# EasyEDA Pro project Breadboard Components.eprj

# Schematic XL74LS04
Board Name: XL74LS04; Create Date: 2024-12-03; Page Name: P1; Project Name: Breadboard Components; Schematic Name: XL74LS04; Update Date: 2024-12-03; Company: EasyEDA.com; Drawn: EasyEDA; Page Size: A4; Part Number: JLCPCB-002; Reviewed: EasyEDA; Version: V0.1
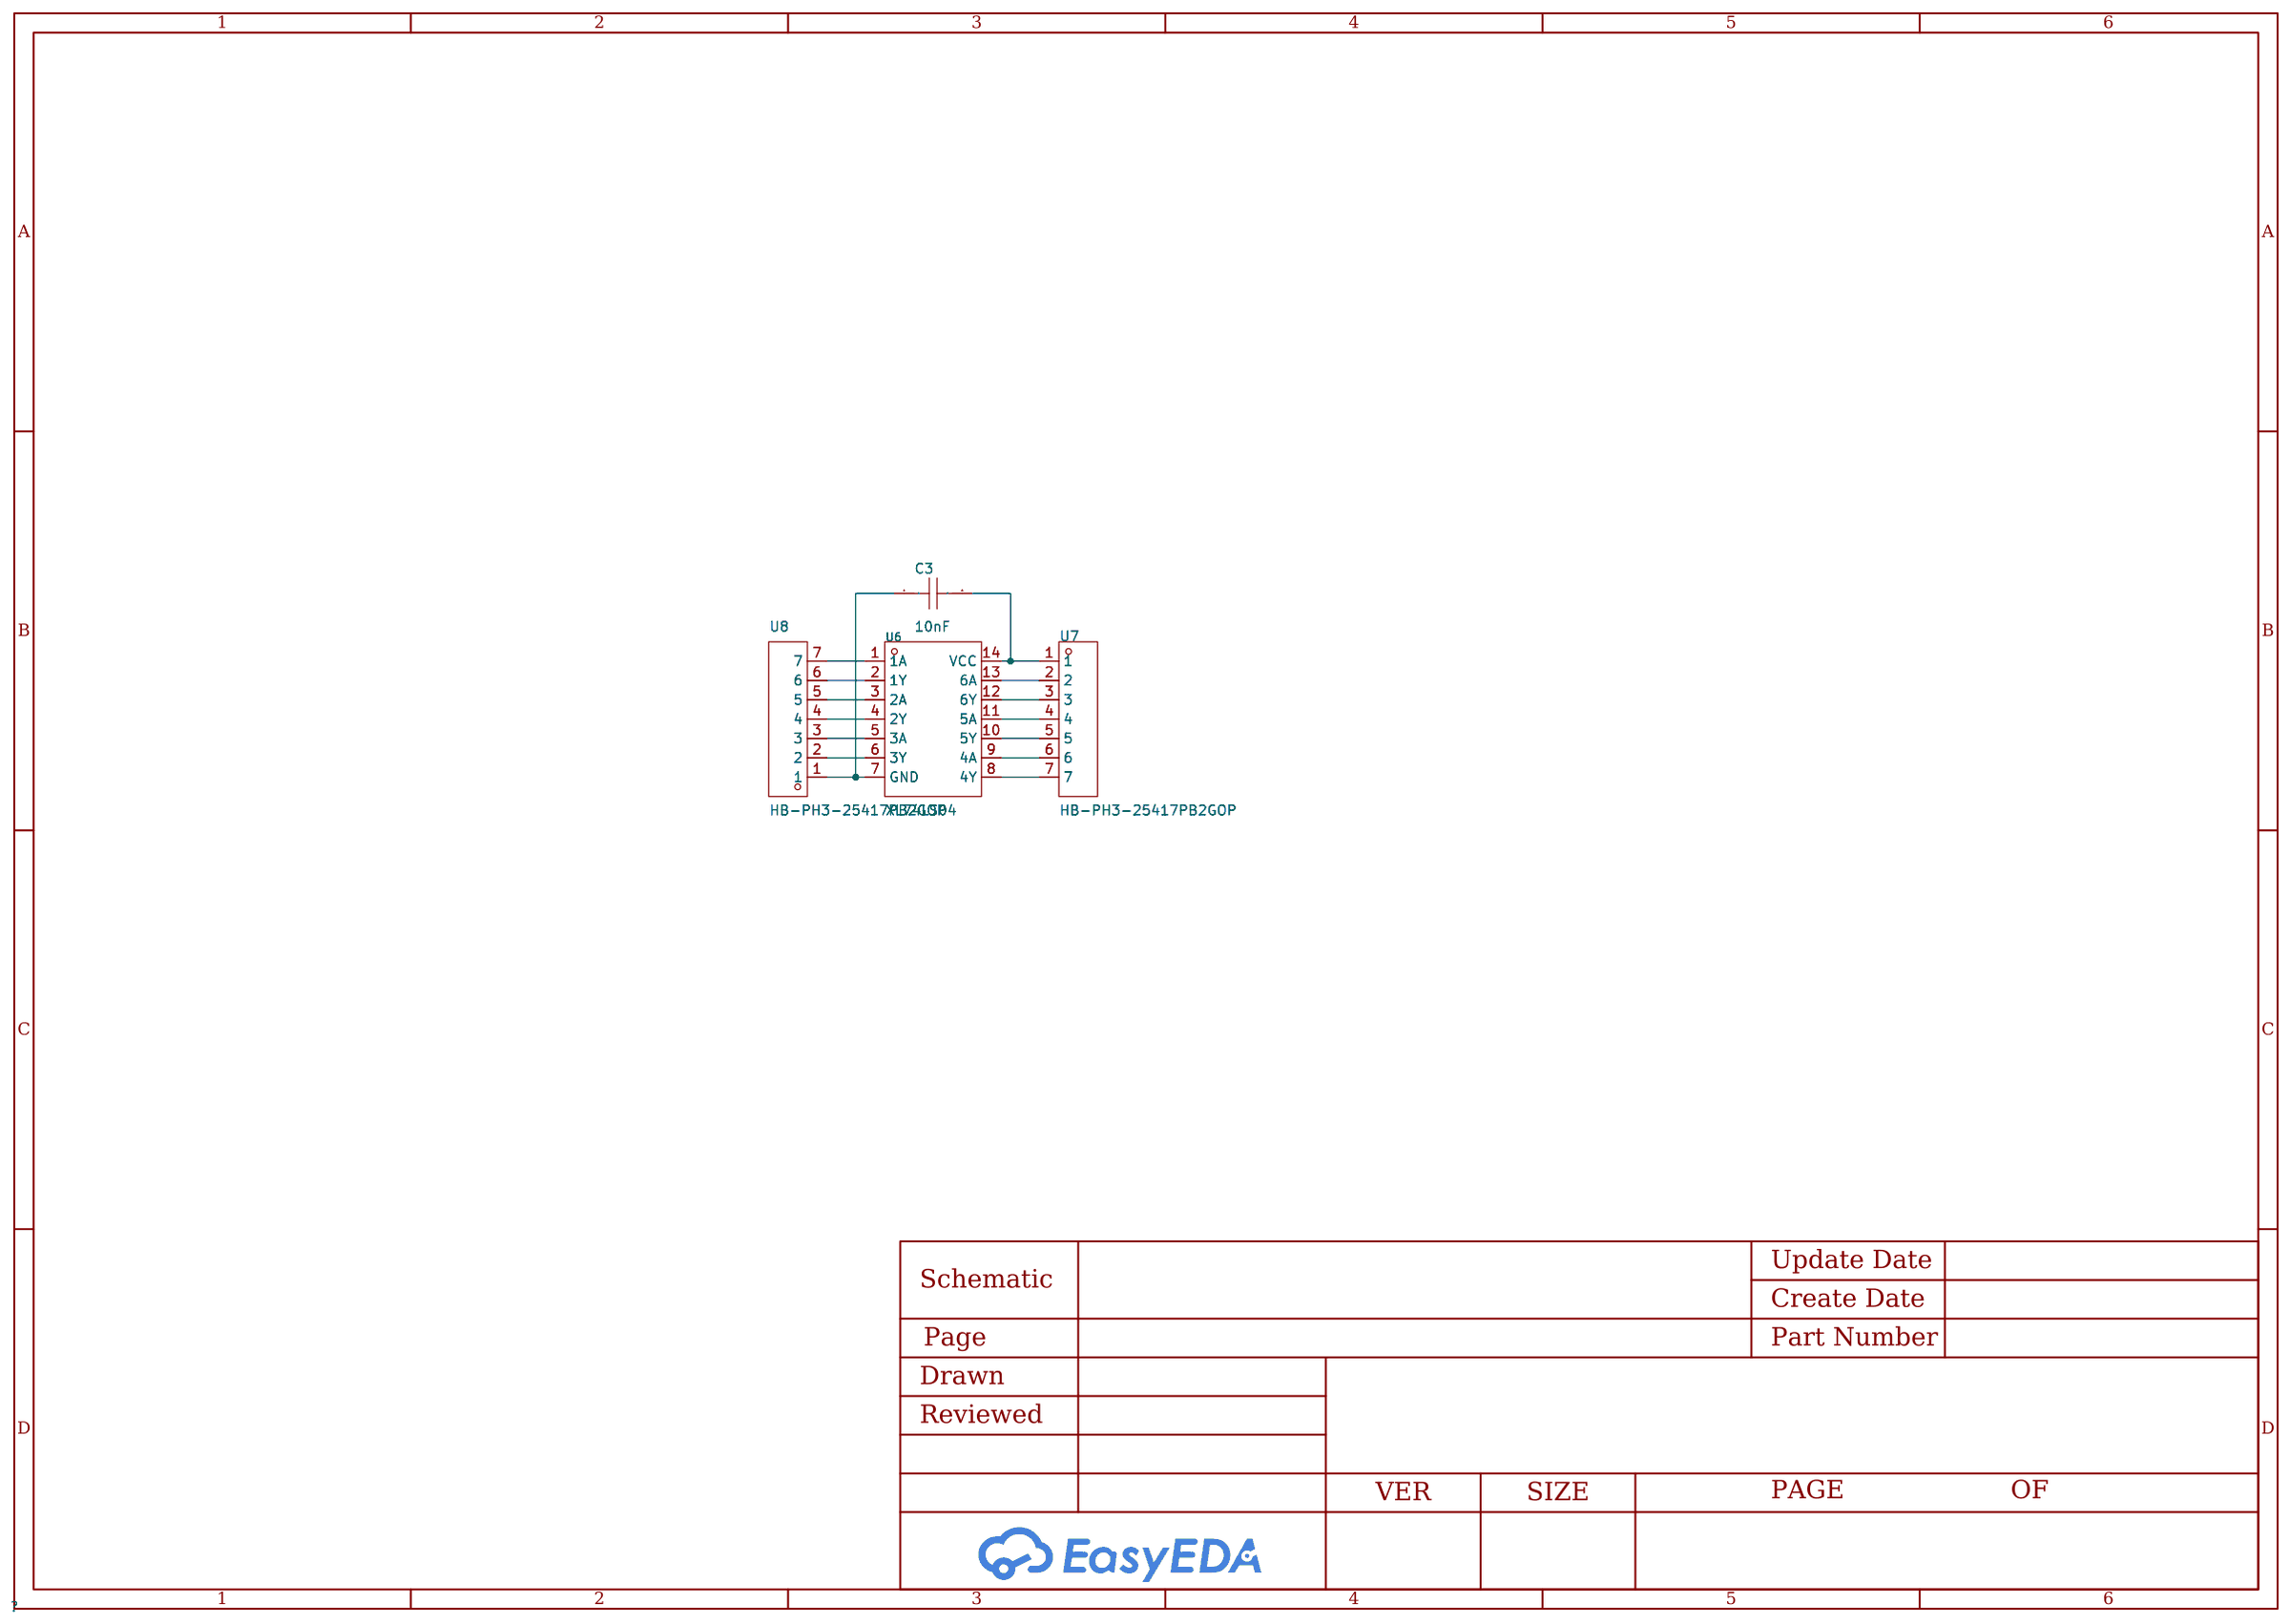
[diagram p0: schematic sheet]

## Parts
C3  10nF  [C0805]
U6  XL74LS04  [SOP-14_L8.6-W3.9-P1.27-LS6.0-BL]
U7  HB-PH3-25417PB2GOP  [HDR-TH_7P-P2.54-V-M]
U8  HB-PH3-25417PB2GOP  [HDR-TH_7P-P2.54-V-M]

## Library data of the parts
C3 = CC0805KRX7R9BB103: Capacitance: Tolerance:±10% Tolerance:±10% Voltage Rated: Temperature Coefficient:; LCSC Part Name: 10nF ±10% 50V; Supplier Part: C83170; Manufacturer: YAGEO(国巨); Supplier Footprint: 0805; JLCPCB Part Class: Extended Part; Datasheet: https://atta.szlcsc.com/upload/public/pdf/source/20170211/1486785656773.pdf; Supplier: LCSC; Tolerance: ±10%
U6 = XL74LS04: LCSC Part Name: 变换器; Supplier Part: C513511; Manufacturer: XINLUDA(信路达); Supplier Footprint: SOP-14; JLCPCB Part Class: Extended Part; Datasheet: https://atta.szlcsc.com/upload/public/pdf/source/20200414/C513511_4295B1BB66C5B6360CE522C95F4B27FF.pdf; Supplier: LCSC
U7 U8 = HB-PH3-25417PB2GOP: LCSC Part Name: 间距:2.54mm 1x7P 直插 方针; Supplier Part: C6332200; Manufacturer: HANBO(汉博); Supplier Footprint: 插件,P=2.54mm; JLCPCB Part Class: Extended Part; Datasheet: https://atta.szlcsc.com/upload/public/pdf/source/20230803/F72D259687963761DF1B552F3BB84A31.pdf; Supplier: LCSC; Pin Structure: 1x7P; Pitch: 2.54mm; Row Spacing: 2.54mm; Circluar Pins/Square Pins: Square Pins; Mounting Type: Straight; Number of Rows: Plugin; Number of Pins: 7P; Current Rating (Max): 3A; Voltage Rating (Max): 250V; Length of Mating Pin: 6mm; Insulation Height: 2.54mm; Length of End Connection Pin: 3mm; Contact Plating: Gold; Operating Temperature Range: -40℃~+105℃; Soldering Temperature(Max): 260℃; Color: Black

## Nets
$1N336: U6.1(1A) U8.7
$1N340: U6.2(1Y) U8.6
$1N345: U6.3(2A) U8.5
$1N350: U6.4(2Y) U8.4
$1N355: U6.5(3A) U8.3
$1N360: U6.6(3Y) U8.2
$1N365: C3.1 U6.7(GND) U8.1
$1N370: U6.8(4Y) U7.7
$1N379: U6.9(4A) U7.6
$1N383: U6.10(5Y) U7.5
$1N388: U6.11(5A) U7.4
$1N393: U6.12(6Y) U7.3
$1N398: U6.13(6A) U7.2
$1N403: C3.2 U6.14(VCC) U7.1

# Schematic 4 Diodes
Board Name: Diodes; Create Date: 2024-12-03; Page Name: P1; Project Name: Breadboard Components; Schematic Name: Schematic1; Update Date: 2024-12-03; Company: EasyEDA.com; Drawn: EasyEDA; Page Size: A4; Part Number: JLCPCB-002; Reviewed: EasyEDA; Version: V0.1
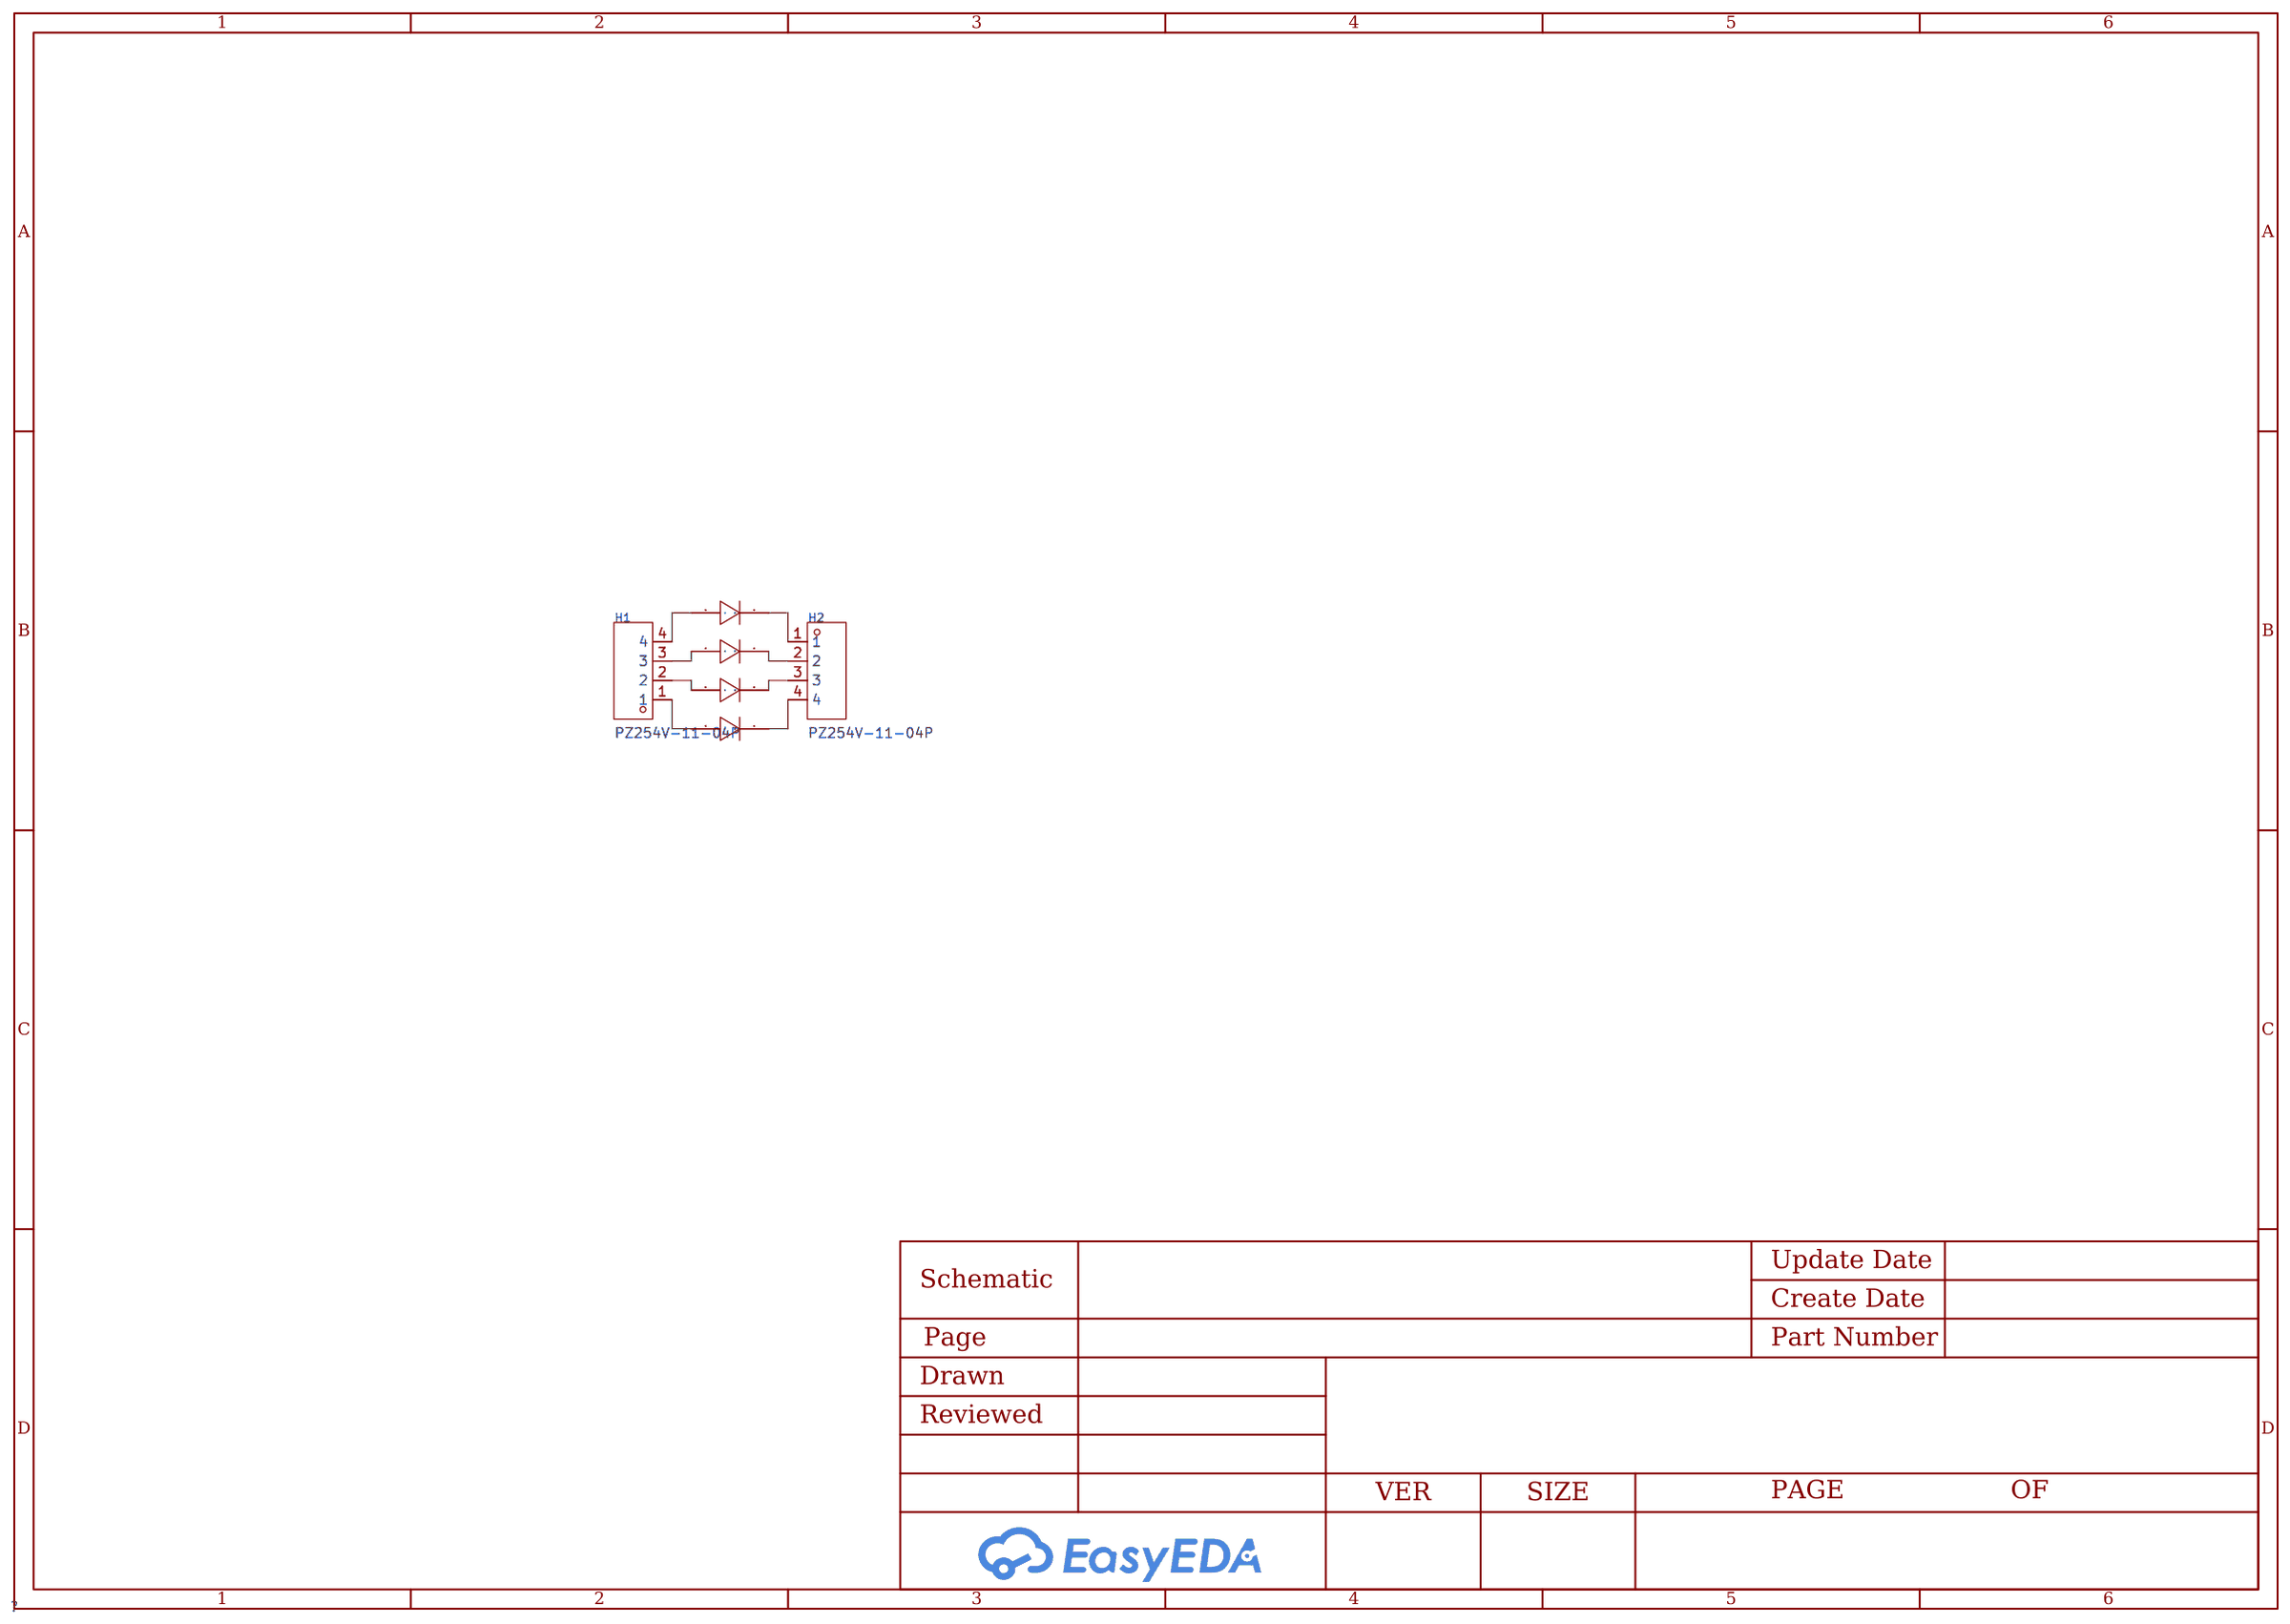
[diagram p1: schematic sheet]

## Parts
D1  SM4007PL  [SOD-123F_L2.8-W1.8-LS3.7-RD]
D2  SM4007PL  [SOD-123F_L2.8-W1.8-LS3.7-RD]
D3  SM4007PL  [SOD-123F_L2.8-W1.8-LS3.7-RD]
D4  SM4007PL  [SOD-123F_L2.8-W1.8-LS3.7-RD]
H1  PZ254V-11-04P  [HDR-TH_4P-P2.54-V-M]
H2  PZ254V-11-04P  [HDR-TH_4P-P2.54-V-M]

## Library data of the parts
D1-D4 = SM4007PL_C64898: Diode Configuration: Forward Voltage (Vf@If):1.1V@1A Reverse Voltage (Vr): Rectified Current: Reverse Leakage Current:10uA@1kV; LCSC Part Name: 电压:1kV 电流:1A; Supplier Part: C64898; Manufacturer: MDD(辰达半导体); Supplier Footprint: SOD-123FL; JLCPCB Part Class: Basic Part; Datasheet: https://atta.szlcsc.com/upload/public/pdf/source/20230823/16A8FDE162764C9B685A3717F2DA3690.pdf; Supplier: LCSC; Forward Voltage (Vf@If): 1.1V@1A; Reverse Leakage Current: 10uA@1kV
H1 H2 = PZ254V-11-04P: LCSC Part Name: 间距:2.54mm 1x4P 直插 方针; Supplier Part: C2691448; Manufacturer: XFCN(兴飞); Supplier Footprint: 插件,P=2.54mm; JLCPCB Part Class: Extended Part; Datasheet: https://atta.szlcsc.com/upload/public/pdf/source/20200309/C492403_F9F19131791D08044AD4F84F8E751A34.pdf; Supplier: LCSC; Pin Structure: 1x4P; Pitch: 2.54mm; Circluar Pins/Square Pins: Square Pins; Mounting Type: Straight; Number of Rows: Plugin; Number of Pins: 4P; Current Rating (Max): 3A; Voltage Rating (Max): 250V; Length of Mating Pin: 6mm; Insulation Height: 2.5mm; Length of End Connection Pin: 3mm; Operating Temperature Range: -40℃~+105℃; Color: Black

## Nets
$1N386: D2.1(C) H2.2
$1N391: D1.1(C) H2.1
$1N397: D3.1(C) H2.3
$1N403: D4.1(C) H2.4
$1N409: D2.2(A) H1.3
$1N414: D3.2(A) H1.2
$1N420: D4.2(A) H1.1
$1N426: D1.2(A) H1.4

# Schematic LP3470A293DBVR
Board Name: IC - LP3470A293DBVR; Create Date: 2024-12-03; Page Name: P1; Project Name: Breadboard Components; Schematic Name: LP3470A293DBVR; Update Date: 2024-12-03; Company: EasyEDA.com; Drawn: EasyEDA; Page Size: A4; Part Number: JLCPCB-002; Reviewed: EasyEDA; Version: V0.1
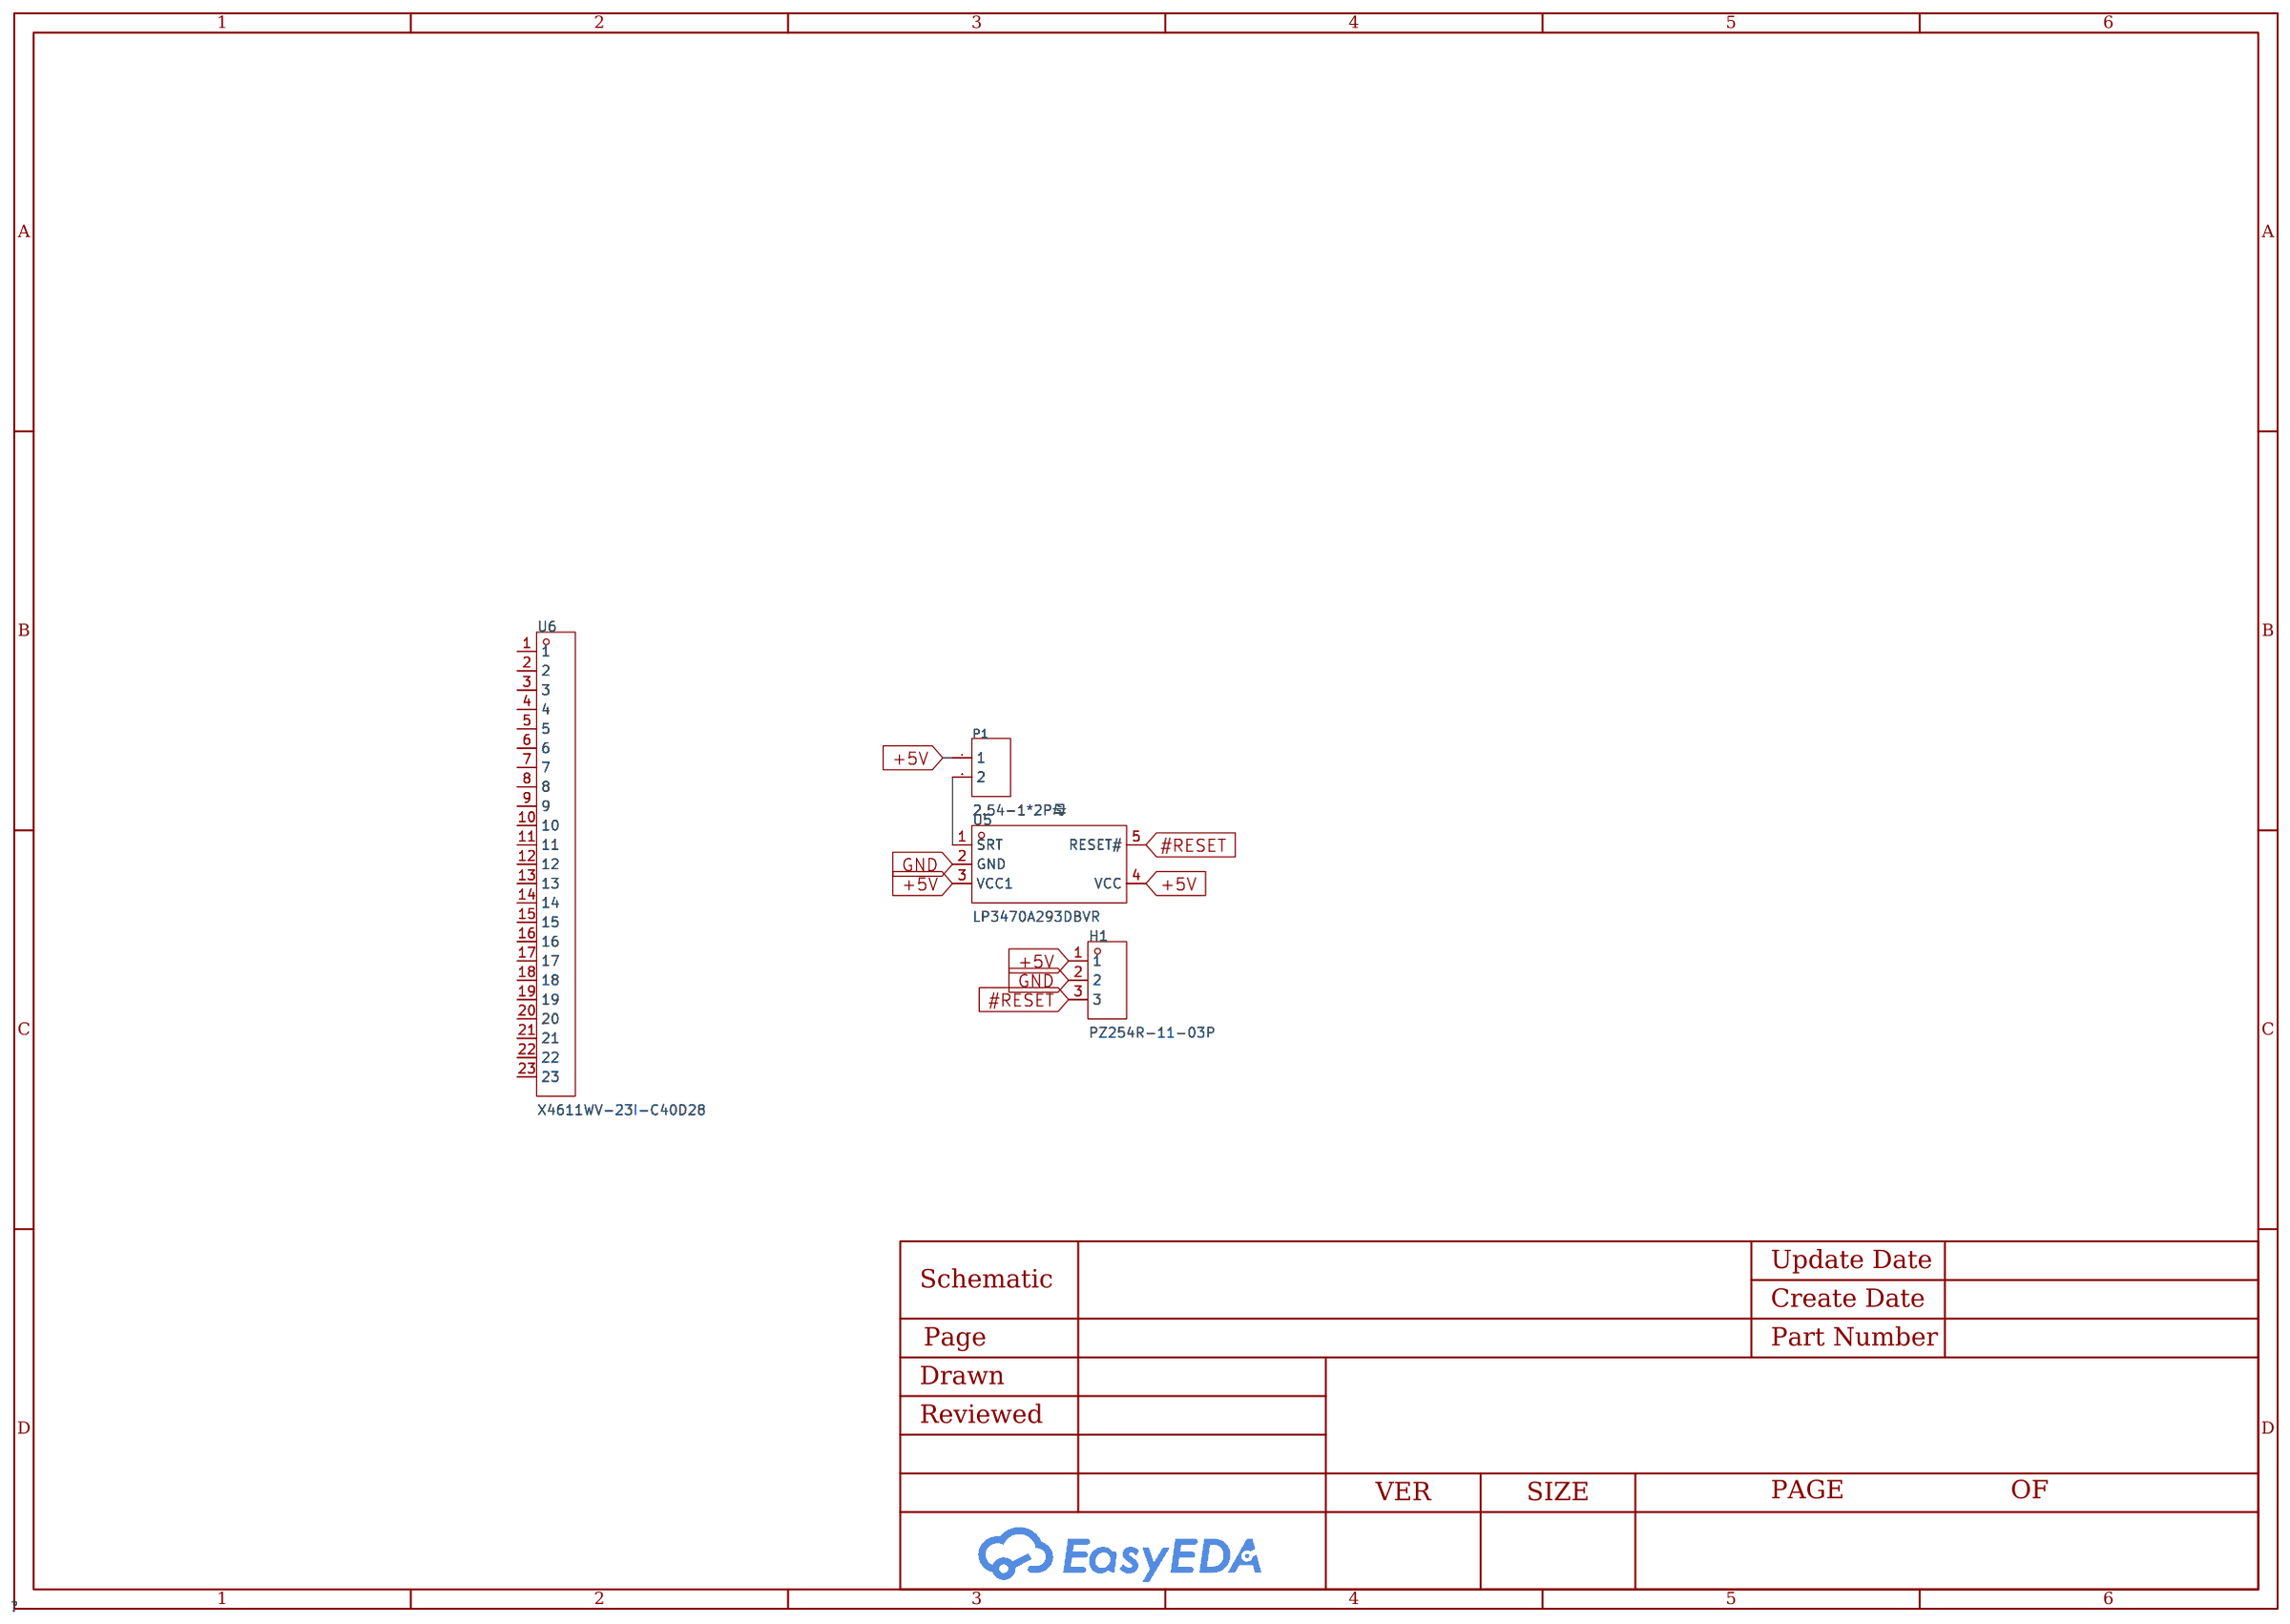
[diagram p2: schematic sheet]

## Parts
H1  PZ254R-11-03P  [HDR-TH_3P-P2.54-H-M-W10.4]
P1  2.54-1*2P母  [HDR-TH_2P-P2.54-V-F]
U5  LP3470A293DBVR  [SOT-23-5_L2.9-W1.6-P0.95-LS2.8-BR]
U6  X4611WV-23I-C40D28  [HDR-TH_23P-P2.00-V-M]

## Library data of the parts
H1 = PZ254R-11-03P: LCSC Part Name: 间距:2.54mm 1x3P 弯插 方针; Supplier Part: C492411; Manufacturer: XFCN(兴飞); Supplier Footprint: 弯插,P=2.54mm; JLCPCB Part Class: Extended Part; Datasheet: https://atta.szlcsc.com/upload/public/pdf/source/20200309/C492411_5256E8AAA7569F6D33B6ADBFAE4F2888.pdf; Supplier: LCSC; Pin Structure: 1x3P; Pitch: 2.54mm; Circluar Pins/Square Pins: Square Pins; Mounting Type: Right-Angle; Number of Rows: Plugin; Number of Pins: 3P; Length of Mating Pin: 6mm; Insulation Height: 2.5mm; Operating Temperature Range: -40℃~+105℃; Color: Black
P1 = 2.54-1*2P母: LCSC Part Name: 间距:2.54mm 1x2P 直插; Supplier Part: C49661; Manufacturer: BOOMELE(博穆精密); Supplier Footprint: 插件,P=2.54mm; JLCPCB Part Class: Extended Part; Datasheet: https://atta.szlcsc.com/upload/public/pdf/source/20210301/C2718488_F4427B881E42CAA8DDB0B1C12B3A522C.pdf; Supplier: LCSC; Holes Structure: 1x2P; Pitch: 2.54mm; Mounting Type: Straight; Number of Rows: Plugin; Number of Holes: 2P
U5 = LP3470A293DBVR: ChipType:Simple reset/Power-on reset Output Type:Leakage Reset Active Level:Active Low Threshold Voltage:2.93V Number of Voltages Monitored:1 Reset Timeout:619ms Operating Temperature:-40℃~+125℃@(TJ) Operating Temperature:-40℃~+125℃@(TJ); Supplier Part: C701947; Manufacturer: TI(德州仪器); Supplier Footprint: SOT-23-5; JLCPCB Part Class: Extended Part; Datasheet: https://www.ti.com/cn/lit/gpn/lp3470a; Supplier: LCSC; ChipType: Simple reset/Power-on reset; Output Type: Leakage; Reset Active Level: Active Low; Threshold Voltage: 2.93V; Number of Voltages Monitored: 1; Reset Timeout: 619ms; Operating Temperature: -40℃~+125℃@(TJ)
U6 = X4611WV-23I-C40D28: LCSC Part Name: 1x23P 间距:2mm 方针; Supplier Part: C2882997; Manufacturer: XKB Connection(中国星坤); Supplier Footprint: 插件,P=2mm; JLCPCB Part Class: Extended Part; Supplier: LCSC; Pin Structure: 1x23P; Pitch: 2mm; Row Spacing: 2mm; Circluar Pins/Square Pins: Square Pins; Number of Rows: Plugin; Number of Pins: 23P; Current Rating (Max): 3A; Voltage Rating (Max): 250V; Insulation Height: 2mm; Contact Plating: Gold; Operating Temperature Range: -40℃~+105℃; Soldering Temperature(Max): 260℃; Color: Black

## Nets
+5V: H1.1 P1.1 U5.3(VCC1) U5.4(VCC)
GND: H1.2 U5.2(GND)
#RESET: H1.3 U5.5(RESET#)
Net-(P1-2): P1.2 U5.1(SRT)

Not connected (* = marked no-connect by the designer): U6 1 2 3 4 5 6 7 8 9 10 11 12 13 14 15 16 17 18 19 20 21 22 23

# Schematic 47 uF Capacitor
Board Name: 47 uF Capacitor; Create Date: 2024-12-03; Page Name: P1; Project Name: Breadboard Components; Schematic Name: 47 uF Capacitor; Update Date: 2024-12-03; Company: EasyEDA.com; Drawn: EasyEDA; Page Size: A4; Part Number: JLCPCB-002; Reviewed: EasyEDA; Version: V0.1
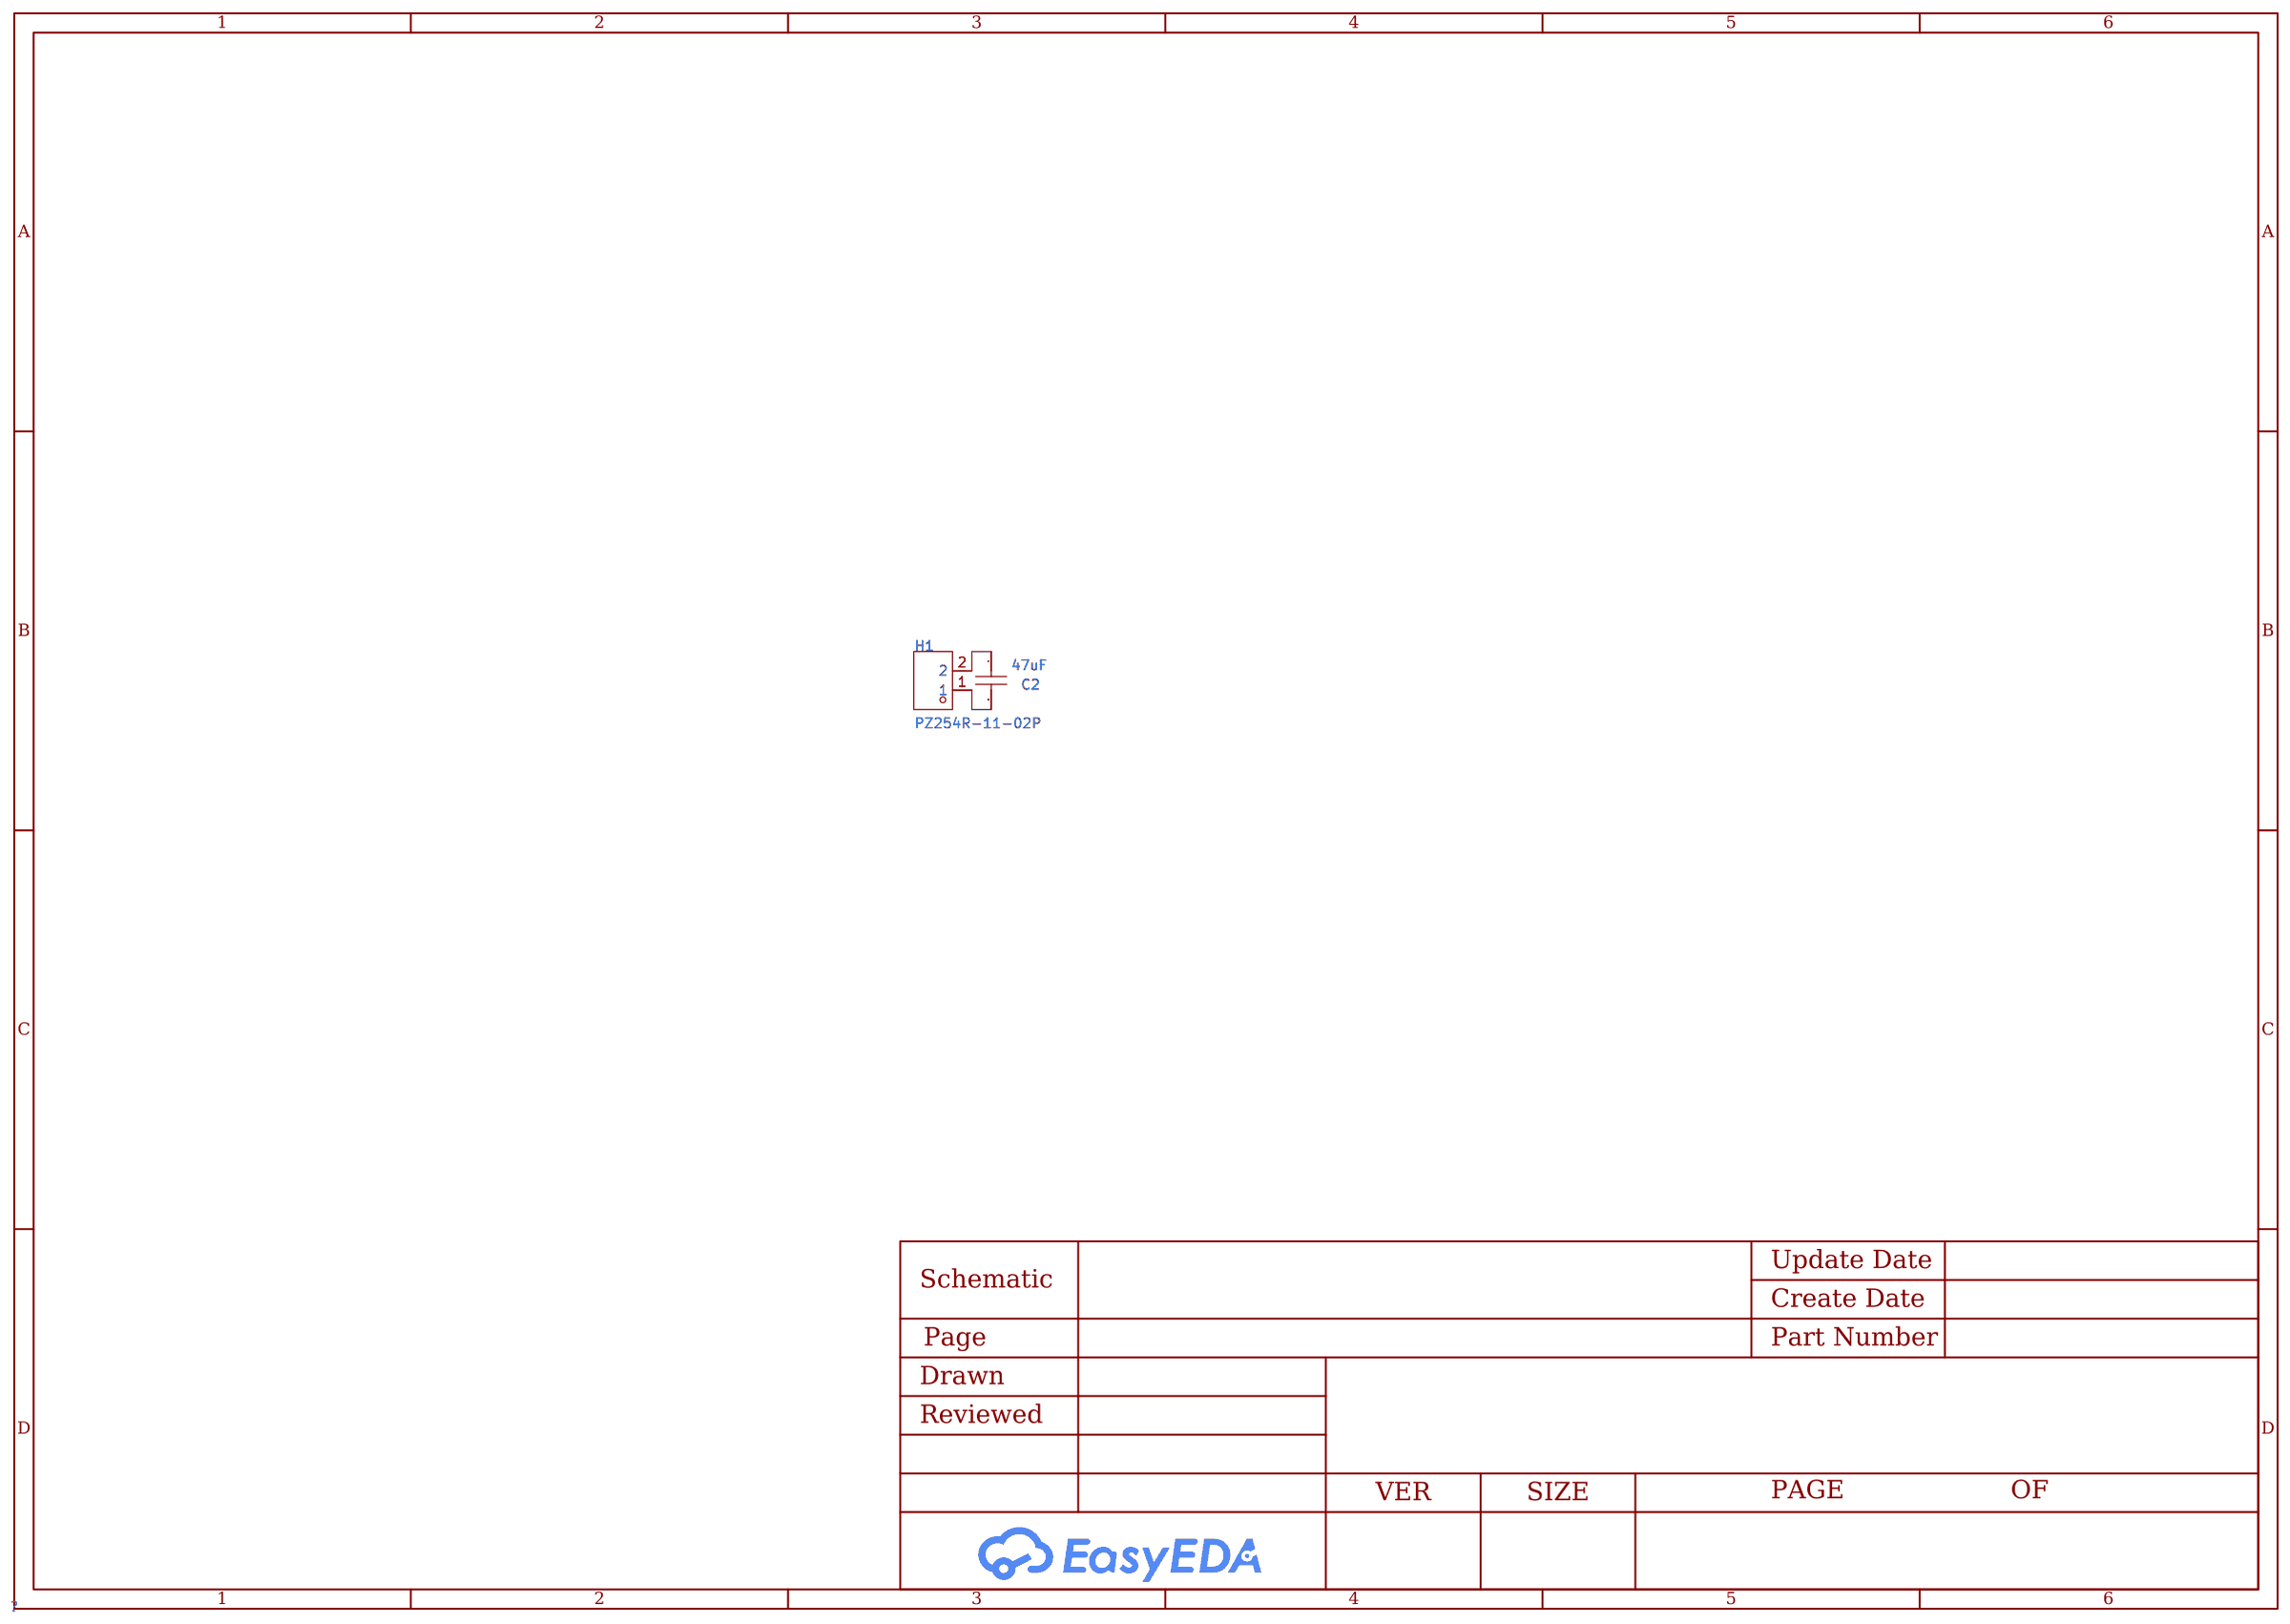
[diagram p3: schematic sheet]

## Parts
C2  47uF  [C1206]
H1  PZ254R-11-02P  [HDR-TH_2P-P2.54-H-M-W10.4]

## Library data of the parts
C2 = CL31A476MQHNNNE: Capacitance: Tolerance:±20% Tolerance:±20% Voltage Rated: Temperature Coefficient:; LCSC Part Name: 47uF ±20% 6.3V; Supplier Part: C68361; Manufacturer: SAMSUNG(三星); Supplier Footprint: 1206; JLCPCB Part Class: Extended Part; Datasheet: https://atta.szlcsc.com/upload/public/pdf/source/20161108/1478586405199.pdf; Supplier: LCSC; Tolerance: ±20%
H1 = PZ254R-11-02P: LCSC Part Name: 间距:2.54mm 1x2P 弯插 方针; Supplier Part: C492410; Manufacturer: XFCN(兴飞); Supplier Footprint: 弯插,P=2.54mm; JLCPCB Part Class: Extended Part; Datasheet: https://atta.szlcsc.com/upload/public/pdf/source/20200309/C492410_AD20A982E51A4870F6FD4D2413672598.pdf; Supplier: LCSC; Pin Structure: 1x2P; Pitch: 2.54mm; Circluar Pins/Square Pins: Square Pins; Mounting Type: Right-Angle; Number of Rows: Plugin; Number of Pins: 2P; Length of Mating Pin: 6mm; Insulation Height: 2.5mm; Operating Temperature Range: -40℃~+105℃; Color: Black

## Nets
$1N168: C2.2 H1.1
$1N173: C2.1 H1.2

# Schematic 4.7kOhm Resistor
Board Name: 4.7kOhm Resistor; Create Date: 2024-12-03; Page Name: P1; Project Name: Breadboard Components; Schematic Name: Schematic1; Update Date: 2024-12-03; Company: EasyEDA.com; Drawn: EasyEDA; Page Size: A4; Part Number: JLCPCB-002; Reviewed: EasyEDA; Version: V0.1
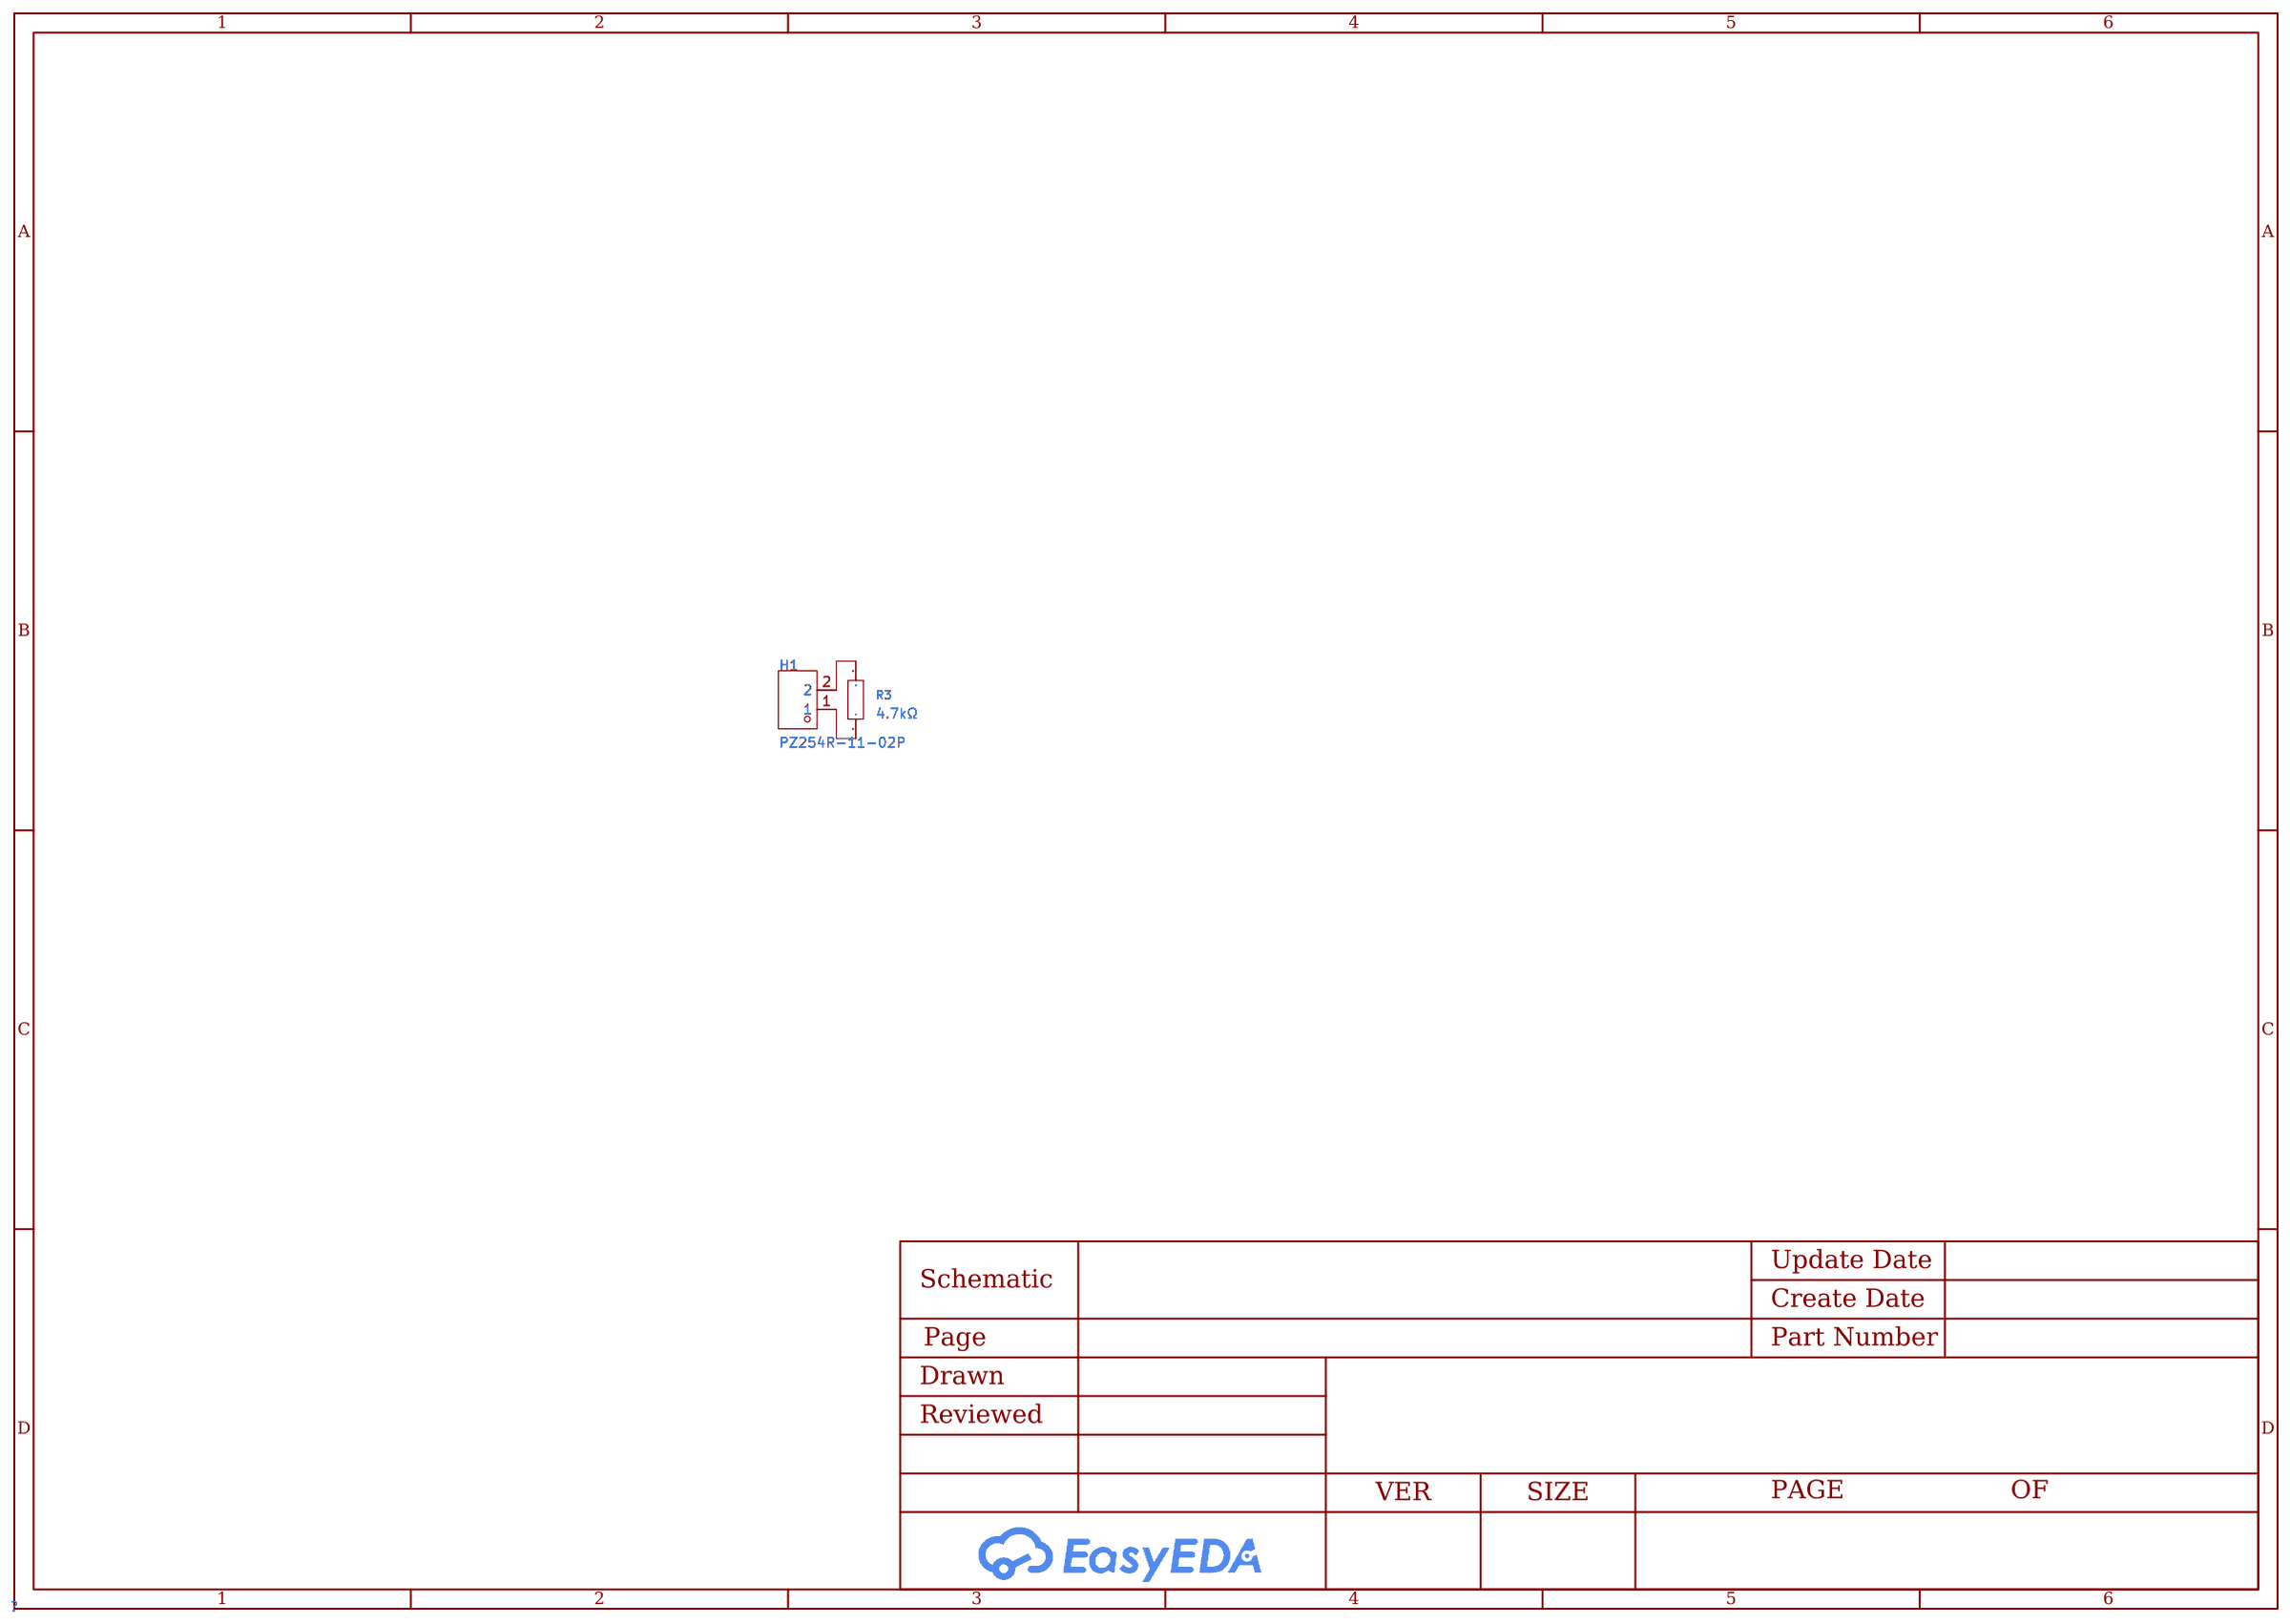
[diagram p4: schematic sheet]

## Parts
H1  PZ254R-11-02P  [HDR-TH_2P-P2.54-H-M-W10.4]
R3  4.7kΩ  [R0805]

## Library data of the parts
H1 = PZ254R-11-02P: LCSC Part Name: 间距:2.54mm 1x2P 弯插 方针; Supplier Part: C492410; Manufacturer: XFCN(兴飞); Supplier Footprint: 弯插,P=2.54mm; JLCPCB Part Class: Extended Part; Datasheet: https://atta.szlcsc.com/upload/public/pdf/source/20200309/C492410_AD20A982E51A4870F6FD4D2413672598.pdf; Supplier: LCSC; Pin Structure: 1x2P; Pitch: 2.54mm; Circluar Pins/Square Pins: Square Pins; Mounting Type: Right-Angle; Number of Rows: Plugin; Number of Pins: 2P; Length of Mating Pin: 6mm; Insulation Height: 2.5mm; Operating Temperature Range: -40℃~+105℃; Color: Black
R3 = 0805W8F4701T5E: Type:Thick Film Resistors Resistance:4.7kΩ Tolerance:±1% Tolerance:±1% Power(Watts): Overload Voltage (Max): Temperature Coefficient:±100ppm/℃ Temperature Coefficient:±100ppm/℃ Operating Temperature Range:-55℃~+155℃ Operating Temperature Range:-55℃~+155℃; LCSC Part Name: 4.7kΩ ±1% 125mW 厚膜电阻; Supplier Part: C17673; Manufacturer: UNI-ROYAL(厚声); Supplier Footprint: 0805; JLCPCB Part Class: Basic Part; Datasheet: https://atta.szlcsc.com/upload/public/pdf/source/20200306/C422600_1E6D84923E4A46A82E41ADD87F860B5C.pdf; Supplier: LCSC; Type: Thick Film Resistors; Tolerance: ±1%; Temperature Coefficient: ±100ppm/℃; Operating Temperature Range: -55℃~+155℃

## Nets
$1N160: H1.1 R3.1
$1N165: H1.2 R3.2

# Schematic 74HC74D,653
Board Name: IC - 74HC74D,653; Create Date: 2024-12-03; Page Name: P1; Project Name: Breadboard Components; Schematic Name: 74HC74D,653; Update Date: 2024-12-03; Company: EasyEDA.com; Drawn: EasyEDA; Page Size: A4; Part Number: JLCPCB-002; Reviewed: EasyEDA; Version: V0.1
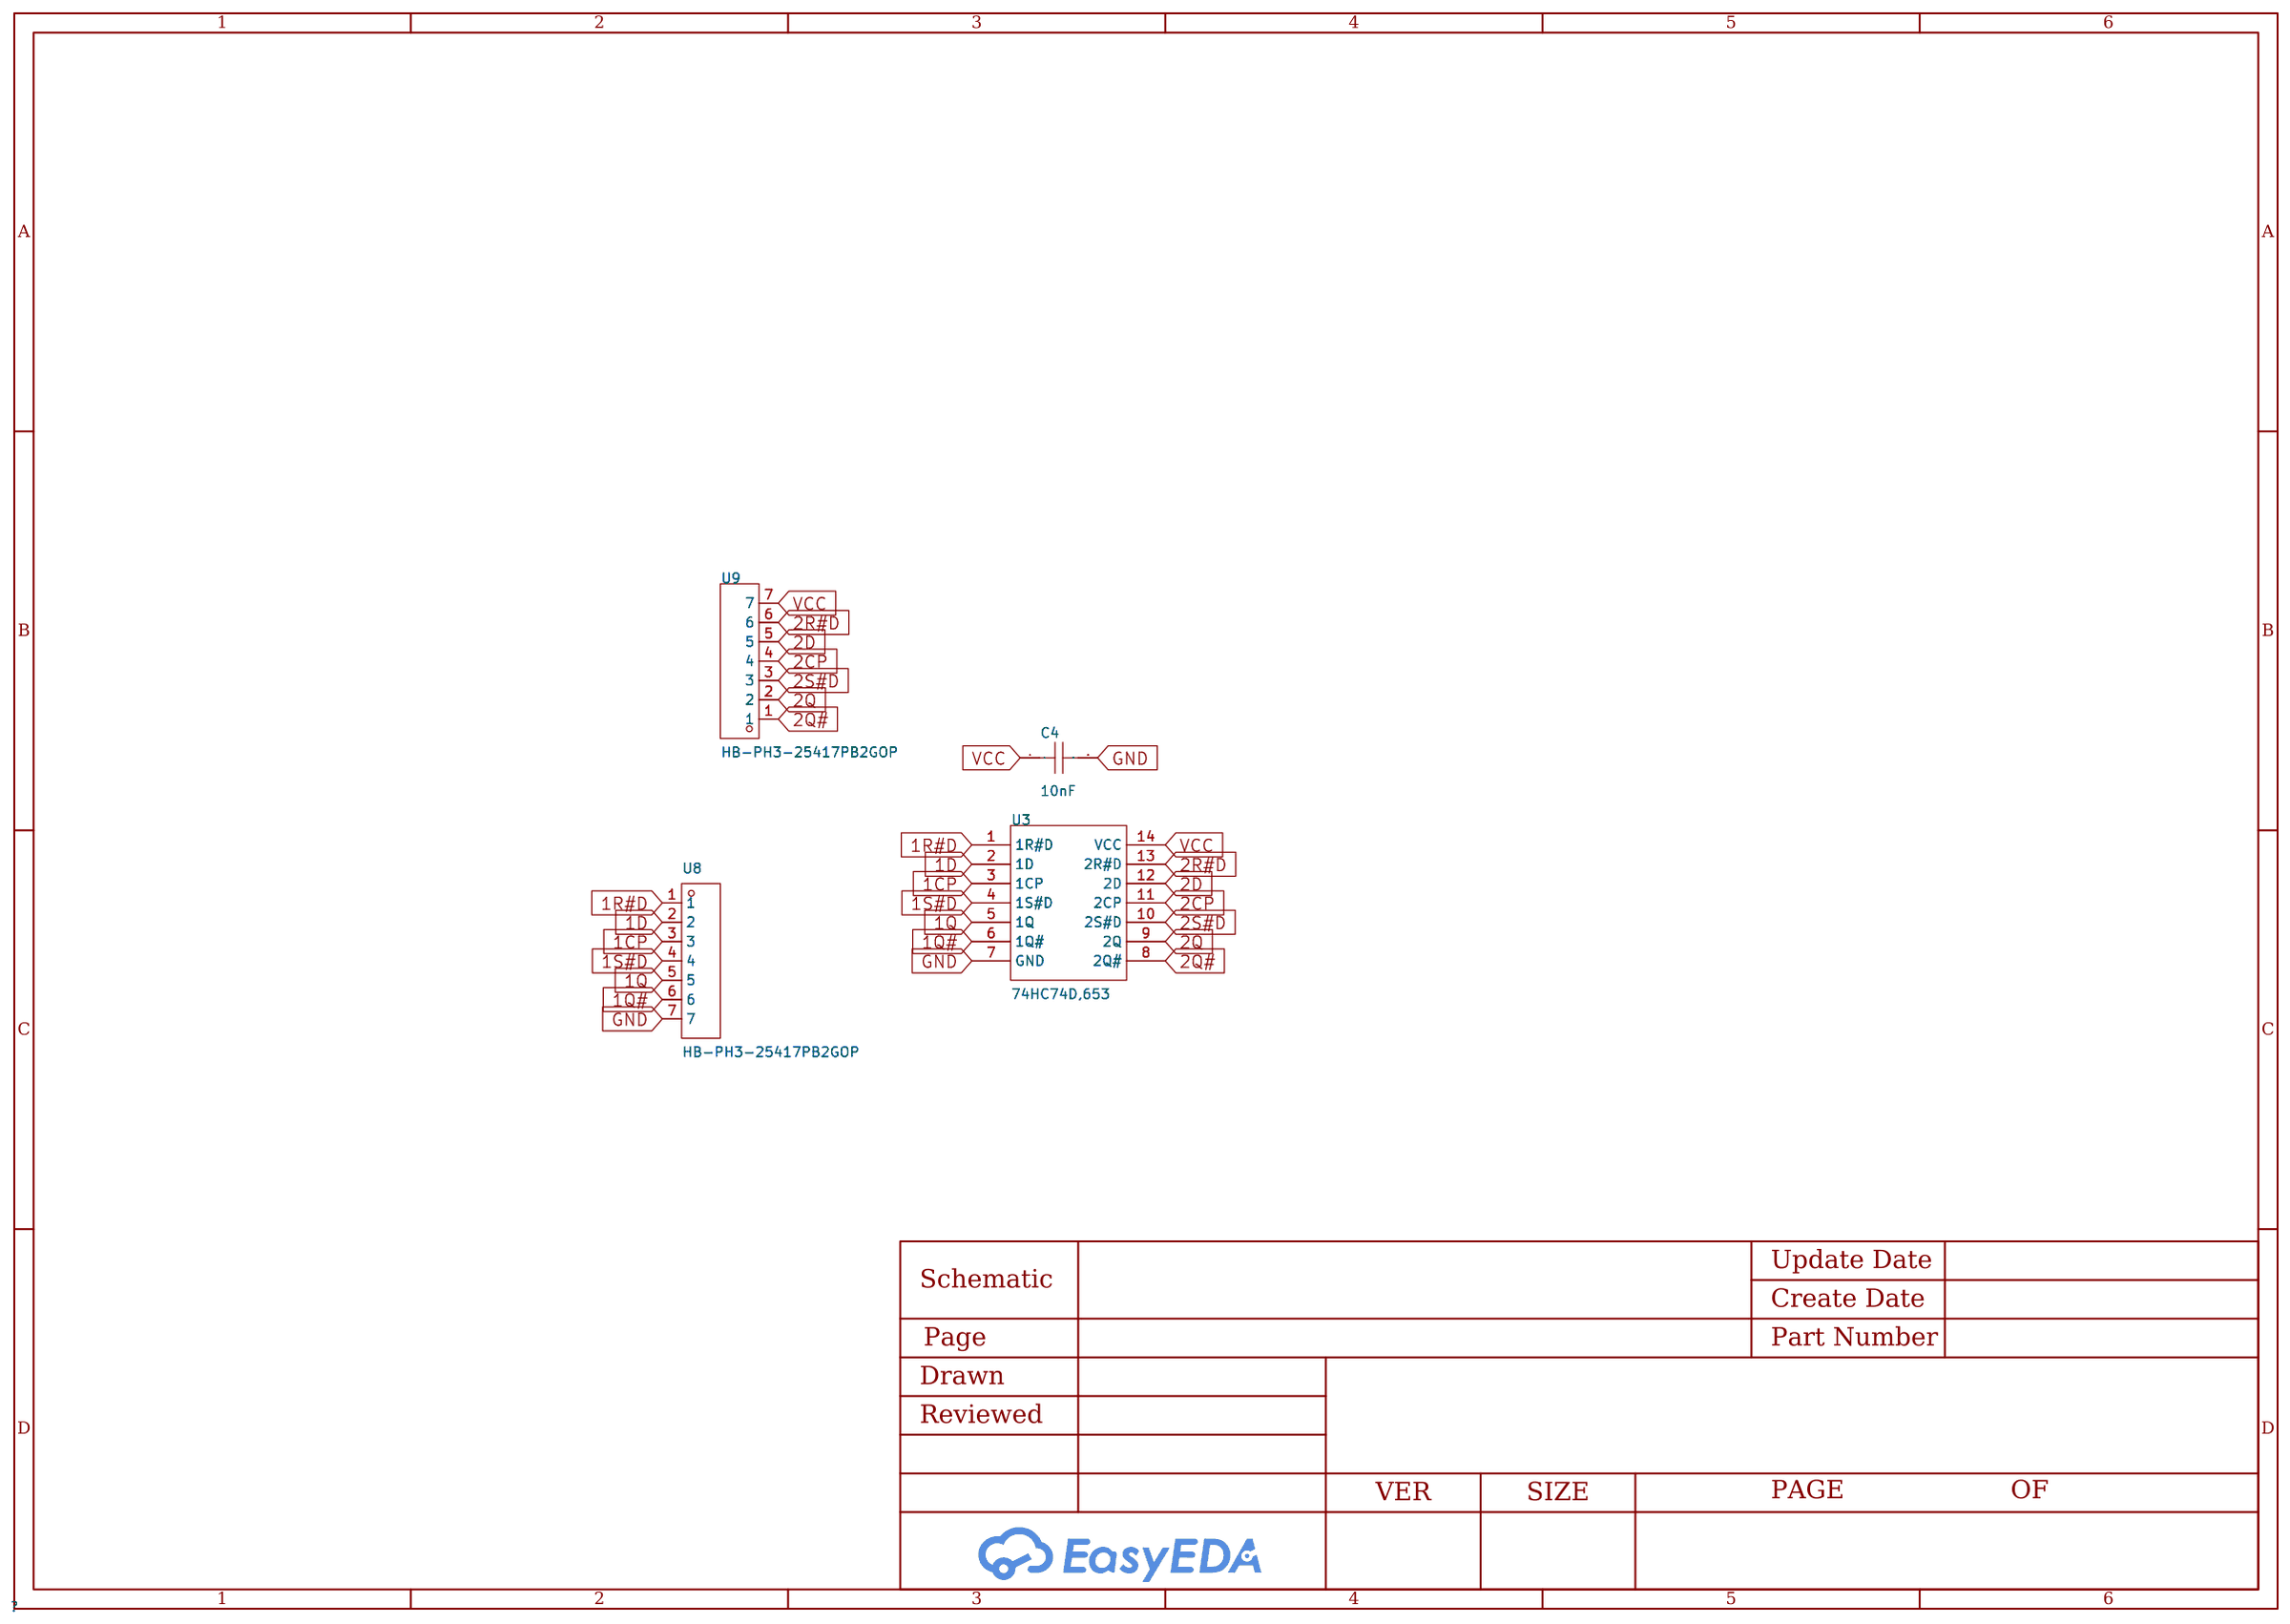
[diagram p5: schematic sheet]

## Parts
C4  10nF  [C0805]
U3  74HC74D,653  [SOIC-14_L8.7-W3.9-P1.27-LS6.0-BL]
U8  HB-PH3-25417PB2GOP  [HDR-TH_7P-P2.54-V-M]
U9  HB-PH3-25417PB2GOP  [HDR-TH_7P-P2.54-V-M]

## Library data of the parts
C4 = CC0805KRX7R9BB103: Capacitance: Tolerance:±10% Tolerance:±10% Voltage Rated: Temperature Coefficient:; LCSC Part Name: 10nF ±10% 50V; Supplier Part: C83170; Manufacturer: YAGEO(国巨); Supplier Footprint: 0805; JLCPCB Part Class: Extended Part; Datasheet: https://atta.szlcsc.com/upload/public/pdf/source/20170211/1486785656773.pdf; Supplier: LCSC; Tolerance: ±10%
U3 = 74HC74D,653: Type:D-Type Trigger Type:Rising Edge Supply Voltage:2V~6V Supply Voltage:2V~6V Clock Frequency:82MHz Function:Positioning and resetting Number of Elements:2 Number of Bits per Element:1 Output Type:Complementary Type Maximum Propagation Delay:37ns@6V,50pF; LCSC Part Name: 双路上升沿D型触发器 具有设置和复位功能; Supplier Part: C27597; Manufacturer: Nexperia(安世); Supplier Footprint: SOIC-14; JLCPCB Part Class: Extended Part; Datasheet: https://atta.szlcsc.com/upload/public/pdf/source/20240724/50ED979ACF83E5FBF4E94DCDA3F36040.pdf; Supplier: LCSC; Type: D-Type; Trigger Type: Rising Edge; Supply Voltage: 2V~6V; Clock Frequency: 82MHz; Function: Positioning and resetting; Number of Elements: 2; Number of Bits per Element: 1; Output Type: Complementary Type; Maximum Propagation Delay: 37ns@6V,50pF; Series: 74HCSeries; Sink Current: 5.2mA; Source Current: 5.2mA; Quiescent Current (Iq): 40uA; Input Capacitance: 3.5pF; Operating Temperature: -40℃~+125℃
U8 U9 = HB-PH3-25417PB2GOP: LCSC Part Name: 间距:2.54mm 1x7P 直插 方针; Supplier Part: C6332200; Manufacturer: HANBO(汉博); Supplier Footprint: 插件,P=2.54mm; JLCPCB Part Class: Extended Part; Datasheet: https://atta.szlcsc.com/upload/public/pdf/source/20230803/F72D259687963761DF1B552F3BB84A31.pdf; Supplier: LCSC; Pin Structure: 1x7P; Pitch: 2.54mm; Row Spacing: 2.54mm; Circluar Pins/Square Pins: Square Pins; Mounting Type: Straight; Number of Rows: Plugin; Number of Pins: 7P; Current Rating (Max): 3A; Voltage Rating (Max): 250V; Length of Mating Pin: 6mm; Insulation Height: 2.54mm; Length of End Connection Pin: 3mm; Contact Plating: Gold; Operating Temperature Range: -40℃~+105℃; Soldering Temperature(Max): 260℃; Color: Black

## Nets
GND: C4.2 U3.7(GND) U8.7
VCC: C4.1 U3.14(VCC) U9.7
1CP: U3.3(1CP) U8.3
1D: U3.2(1D) U8.2
1Q: U3.5(1Q) U8.5
1Q#: U3.6(1Q#) U8.6
1R#D: U3.1(1R#D) U8.1
1S#D: U3.4(1S#D) U8.4
2CP: U3.11(2CP) U9.4
2D: U3.12(2D) U9.5
2Q: U3.9(2Q) U9.2
2Q#: U3.8(2Q#) U9.1
2R#D: U3.13(2R#D) U9.6
2S#D: U3.10(2S#D) U9.3

# Schematic 4 LED's
Board Name: 4 LED's - X; Create Date: 2024-12-04; Page Name: P1; Project Name: Breadboard Components; Schematic Name: 4 LED's; Update Date: 2024-12-04; Company: EasyEDA.com; Drawn: EasyEDA; Page Size: A4; Part Number: JLCPCB-002; Reviewed: EasyEDA; Version: V0.1
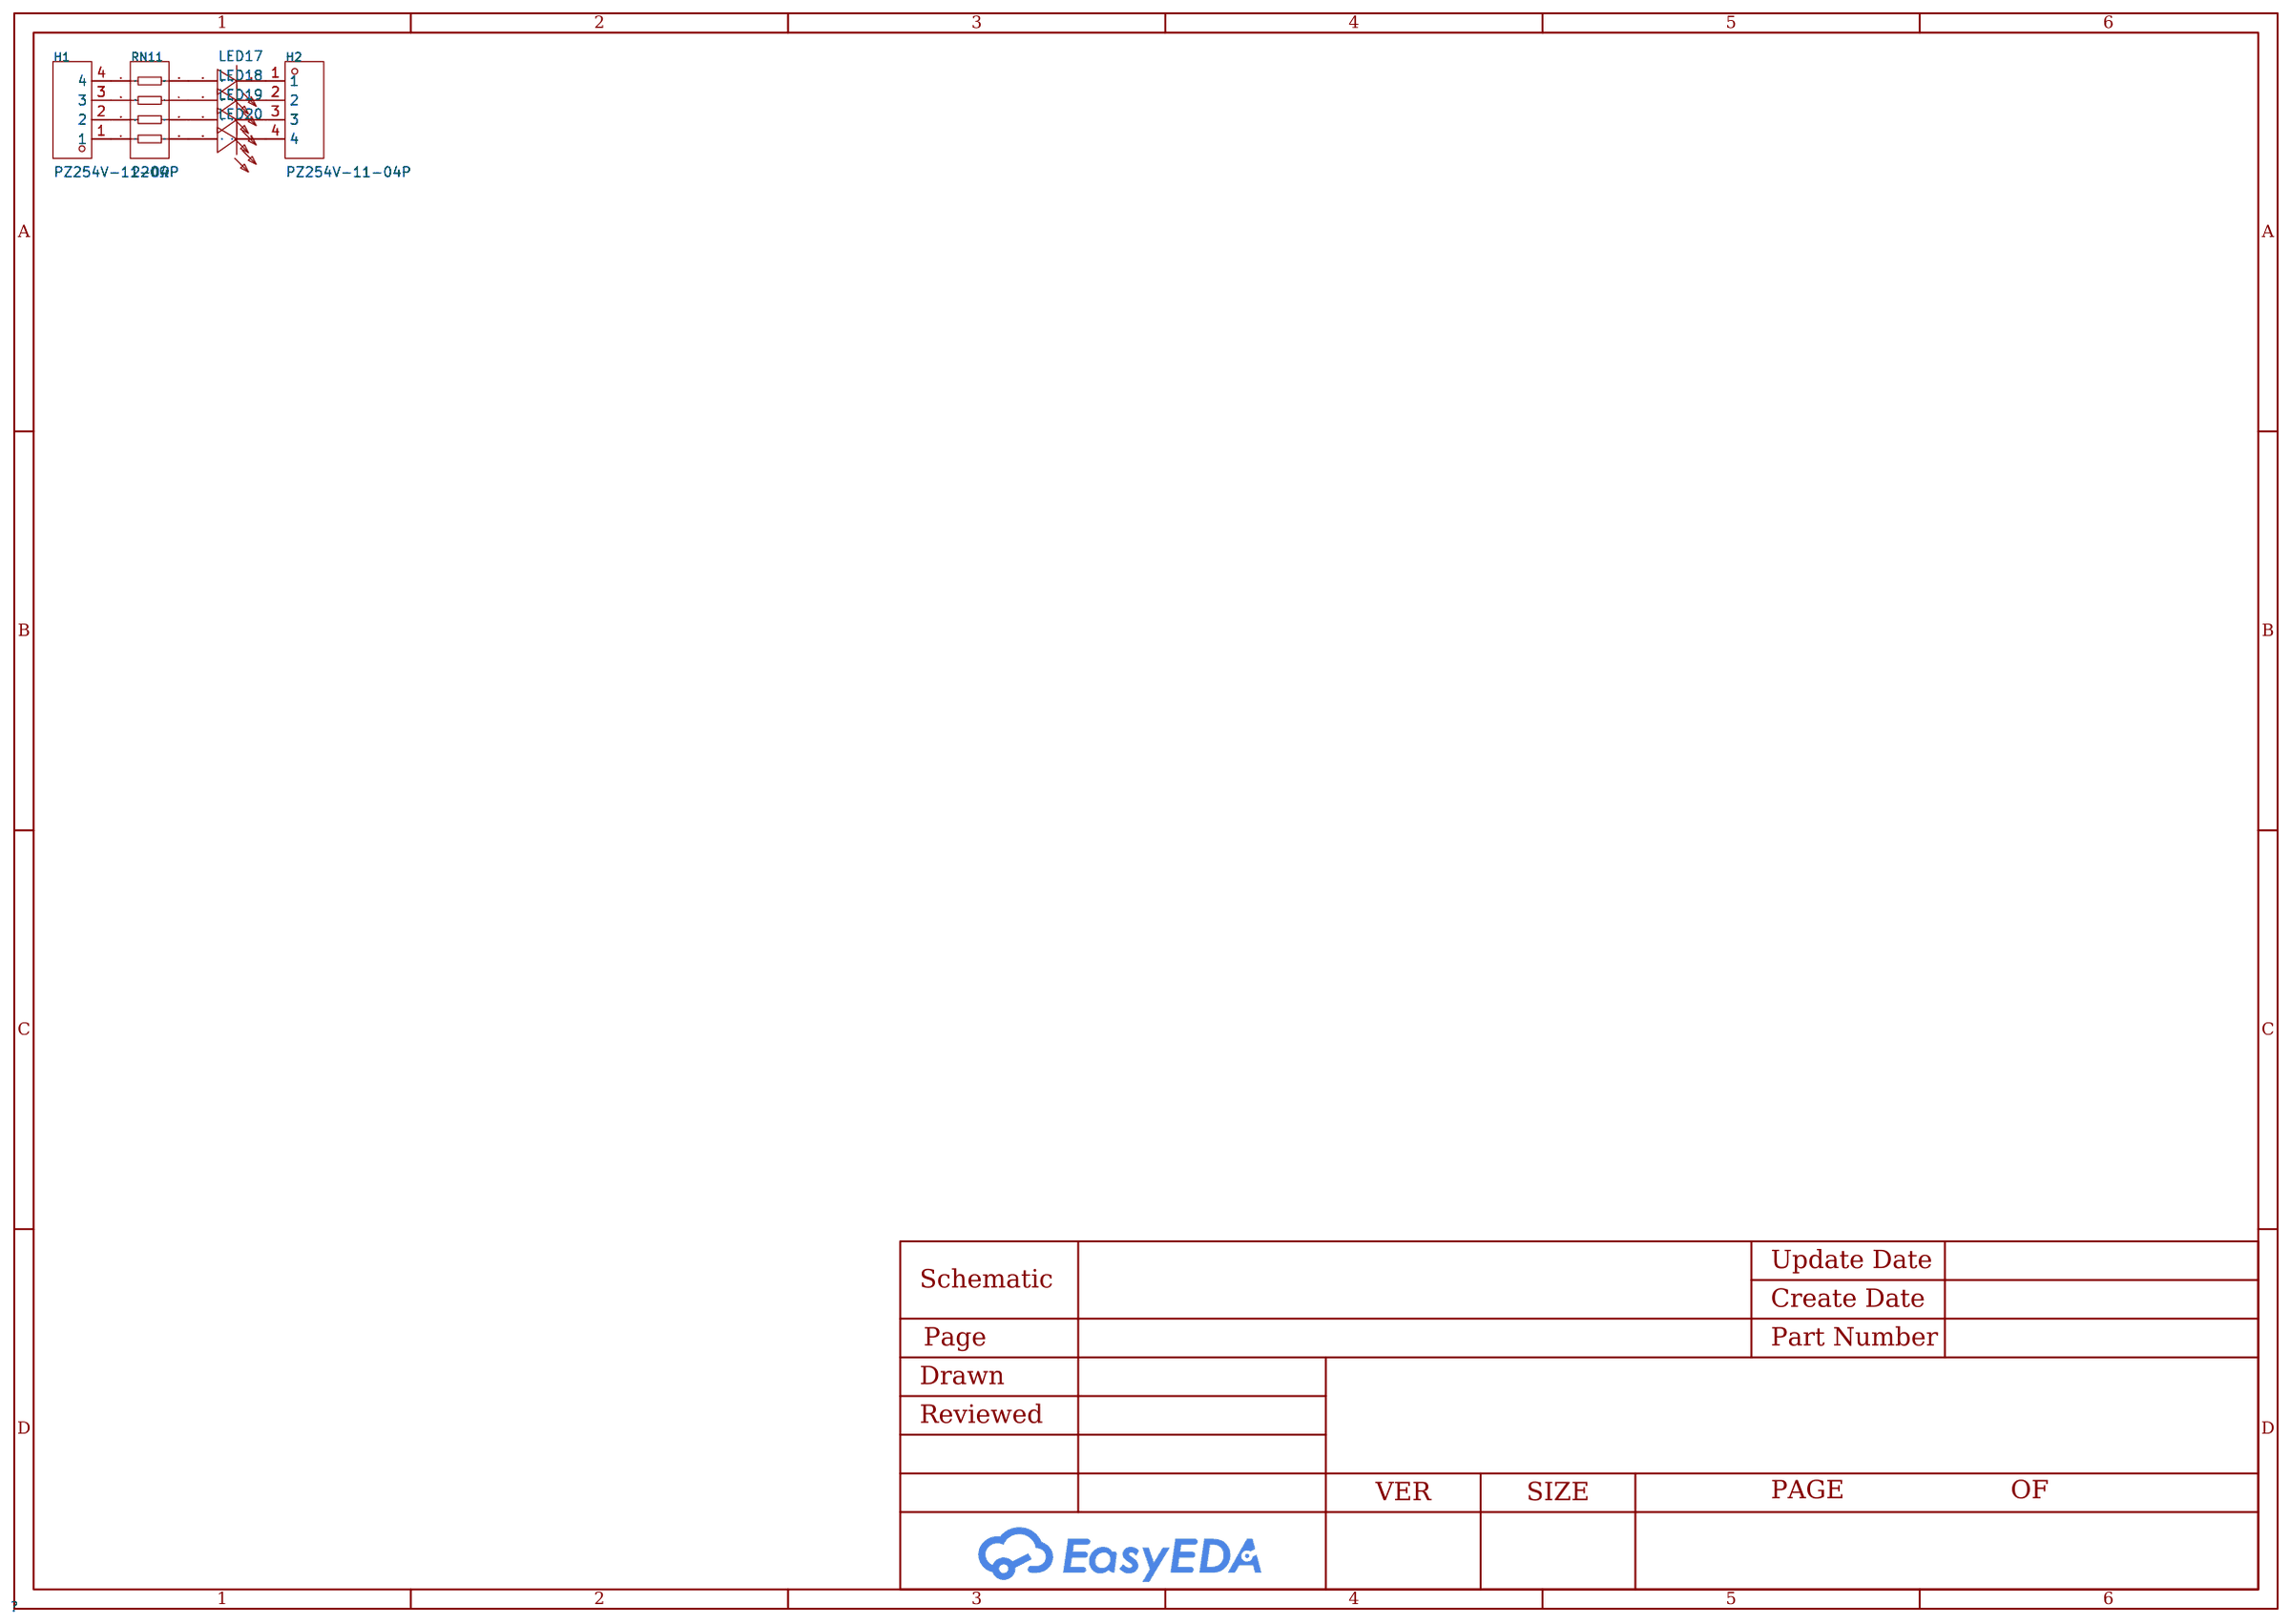
[diagram p6: schematic sheet]

## Parts
H1  PZ254V-11-04P  [HDR-TH_4P-P2.54-V-M]
H2  PZ254V-11-04P  [HDR-TH_4P-P2.54-V-M]
LED17  HL-PT-1608S52FC-L  [LED0603-RD_RED]
LED18  HL-PT-1608S52FC-L  [LED0603-RD_RED]
LED19  HL-PT-1608S52FC-L  [LED0603-RD_RED]
LED20  HL-PT-1608S52FC-L  [LED0603-RD_RED]
RN11  220Ω  [RES-ARRAY-SMD_0603-8P-L3.2-W1.6-BL]

## Library data of the parts
H1 H2 = PZ254V-11-04P: LCSC Part Name: 间距:2.54mm 1x4P 直插 方针; Supplier Part: C2691448; Manufacturer: XFCN(兴飞); Supplier Footprint: 插件,P=2.54mm; JLCPCB Part Class: Extended Part; Datasheet: https://atta.szlcsc.com/upload/public/pdf/source/20200309/C492403_F9F19131791D08044AD4F84F8E751A34.pdf; Supplier: LCSC; Pin Structure: 1x4P; Pitch: 2.54mm; Circluar Pins/Square Pins: Square Pins; Mounting Type: Straight; Number of Rows: Plugin; Number of Pins: 4P; Current Rating (Max): 3A; Voltage Rating (Max): 250V; Length of Mating Pin: 6mm; Insulation Height: 2.5mm; Length of End Connection Pin: 3mm; Operating Temperature Range: -40℃~+105℃; Color: Black
LED17-LED20 = HL-PT-1608S52FC-L: Emitted Color:Red Forward Voltage (VF):2.5V Forward Voltage (VF):2.5V Power Dissipation:50mW Forward Current:10mA Dominant Wavelength:620nm Dominant Wavelength:620nm Lens Color:无色透明透镜 Color Temperature:- Color Temperature:- Luminous Intensity:120mcd Lumin; Supplier Part: C497917; Manufacturer: HONGLITRONIC(鸿利光电); Supplier Footprint: 0603; JLCPCB Part Class: Extended Part; Datasheet: https://atta.szlcsc.com/upload/public/pdf/source/20200323/C497918_6BBA4137D45587D337CC6460762D4319.pdf; Supplier: LCSC; Emitted Color: Red; Forward Voltage (VF): 2.5V; Power Dissipation: 50mW; Forward Current: 10mA; Dominant Wavelength: 620nm; Lens Color: 无色透明透镜; Luminous Intensity: 120mcd; Viewing Angle: 130°; Mounting Sytle: Positive post; Operating Temperature: -40℃~+85℃
RN11 = 4D03WGF2200T5E: Number of Resistors: Resistance: Tolerance:±1% Tolerance:±1% Power(Watts): Temperature Coefficient:±200ppm/℃ Temperature Coefficient:±200ppm/℃ Number of Pins:; LCSC Part Name: 220Ω ±1% 0603x4; Supplier Part: C497939; Manufacturer: UNI-ROYAL(厚声); Supplier Footprint: 0603x4; JLCPCB Part Class: Extended Part; Datasheet: https://atta.szlcsc.com/upload/public/pdf/source/20191224/C474318_2527498AE30E813171187CCD28401A71.pdf; Supplier: LCSC; Tolerance: ±1%; Temperature Coefficient: ±200ppm/℃

## Nets
$1N186: LED17.2(A) RN11.8
$1N229: LED18.2(A) RN11.7
$1N272: LED19.2(A) RN11.6
$1N315: LED20.2(A) RN11.5
$1N368: H2.1 LED17.1(K)
$1N370: H2.2 LED18.1(K)
$1N372: H2.3 LED19.1(K)
$1N374: H2.4 LED20.1(K)
$1N376: H1.1 RN11.4
$1N378: H1.2 RN11.3
$1N380: H1.3 RN11.2
$1N382: H1.4 RN11.1

# Schematic Push-Switch
Board Name: Push-Switch - X; Create Date: 2024-12-04; Page Name: P1; Project Name: Breadboard Components; Schematic Name: Push-Switch; Update Date: 2024-12-04; Company: EasyEDA.com; Drawn: EasyEDA; Page Size: A4; Part Number: JLCPCB-002; Reviewed: EasyEDA; Version: V0.1
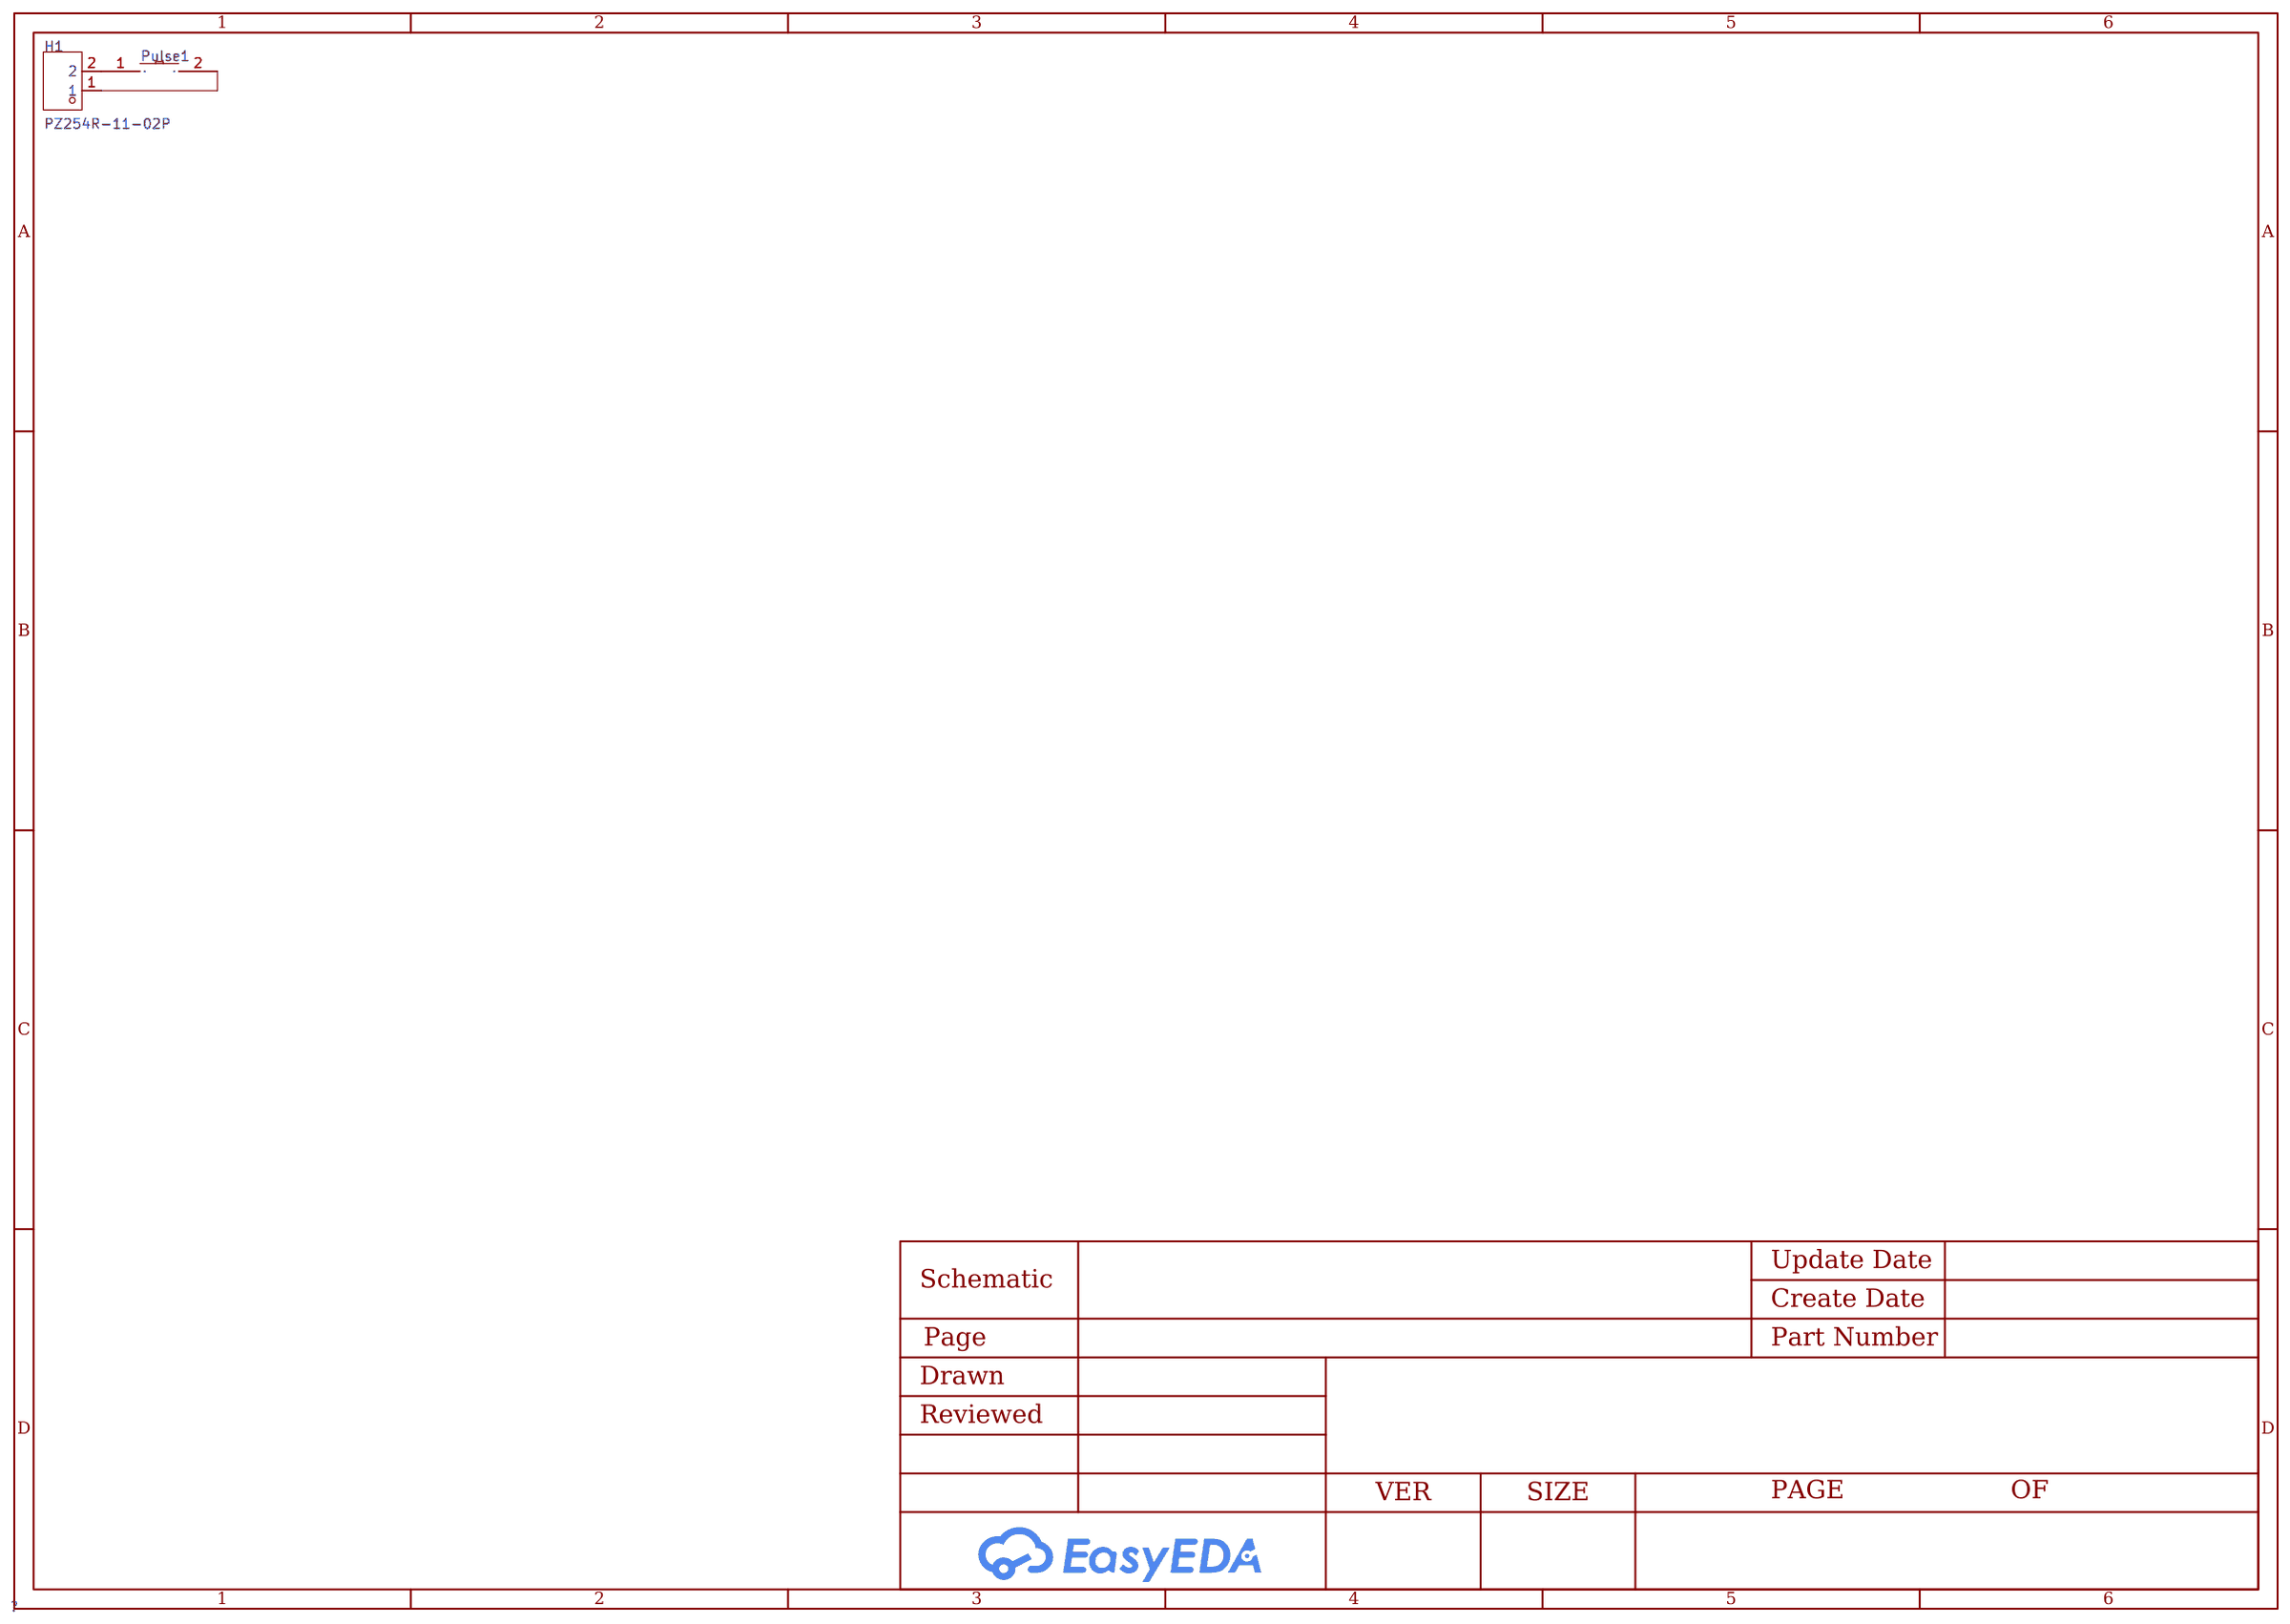
[diagram p7: schematic sheet]

## Parts
H1  PZ254R-11-02P  [HDR-TH_2P-P2.54-H-M-W10.4]
Pulse1  TS-1101-C-W  [SW-SMD_L6.0-W3.3-LS8.0]

## Library data of the parts
H1 = PZ254R-11-02P: LCSC Part Name: 间距:2.54mm 1x2P 弯插 方针; Supplier Part: C492410; Manufacturer: XFCN(兴飞); Supplier Footprint: 弯插,P=2.54mm; JLCPCB Part Class: Extended Part; Datasheet: https://atta.szlcsc.com/upload/public/pdf/source/20200309/C492410_AD20A982E51A4870F6FD4D2413672598.pdf; Supplier: LCSC; Pin Structure: 1x2P; Pitch: 2.54mm; Circluar Pins/Square Pins: Square Pins; Mounting Type: Right-Angle; Number of Rows: Plugin; Number of Pins: 2P; Length of Mating Pin: 6mm; Insulation Height: 2.5mm; Operating Temperature Range: -40℃~+105℃; Color: Black
Pulse1 = TS-1101-C-W: Circuit:SPST Actuator Style:Rectangle button Operating Force:260gf Mounting Style:Brick nogging Switch Length:6mm Switch Width:3.6mm Switch Height:2.5mm Strike Gundam:不带 Contact Current:50mA Voltage Rating (AC):- Voltage Rating (DC):12V Power Rating:- Ins; LCSC Part Name: 6*3.6*2.5mm 立贴 轻触开关; Supplier Part: C318938; Manufacturer: XKB Connectivity(中国星坤); Supplier Footprint: SMD; JLCPCB Part Class: Extended Part; Datasheet: https://atta.szlcsc.com/upload/public/pdf/source/20200227/C318938_C2E53B1EEDE37D980A33616AC086DE53.pdf; Supplier: LCSC; Circuit: SPST; Actuator Style: Rectangle button; Operating Force: 260gf; Mounting Style: Brick nogging; Switch Length: 6mm; Switch Width: 3.6mm; Switch Height: 2.5mm; Strike Gundam: 不带; Contact Current: 50mA; Voltage Rating (DC): 12V; Actuator/Cap Color: 白色带淡绿; With Lamp: No; Mechanical Life: 5万次; Operating Temperature: -30℃~+85℃

## Nets
$1N134: H1.2 Pulse1.1
$1N138: H1.1 Pulse1.2

# Schematic 10 uF Capacitor
Board Name: 10 uF Capacitor - X; Create Date: 2024-12-04; Page Name: P1; Project Name: Breadboard Components; Schematic Name: 10 uF Capacitor; Update Date: 2024-12-04; Company: EasyEDA.com; Drawn: EasyEDA; Page Size: A4; Part Number: JLCPCB-002; Reviewed: EasyEDA; Version: V0.1
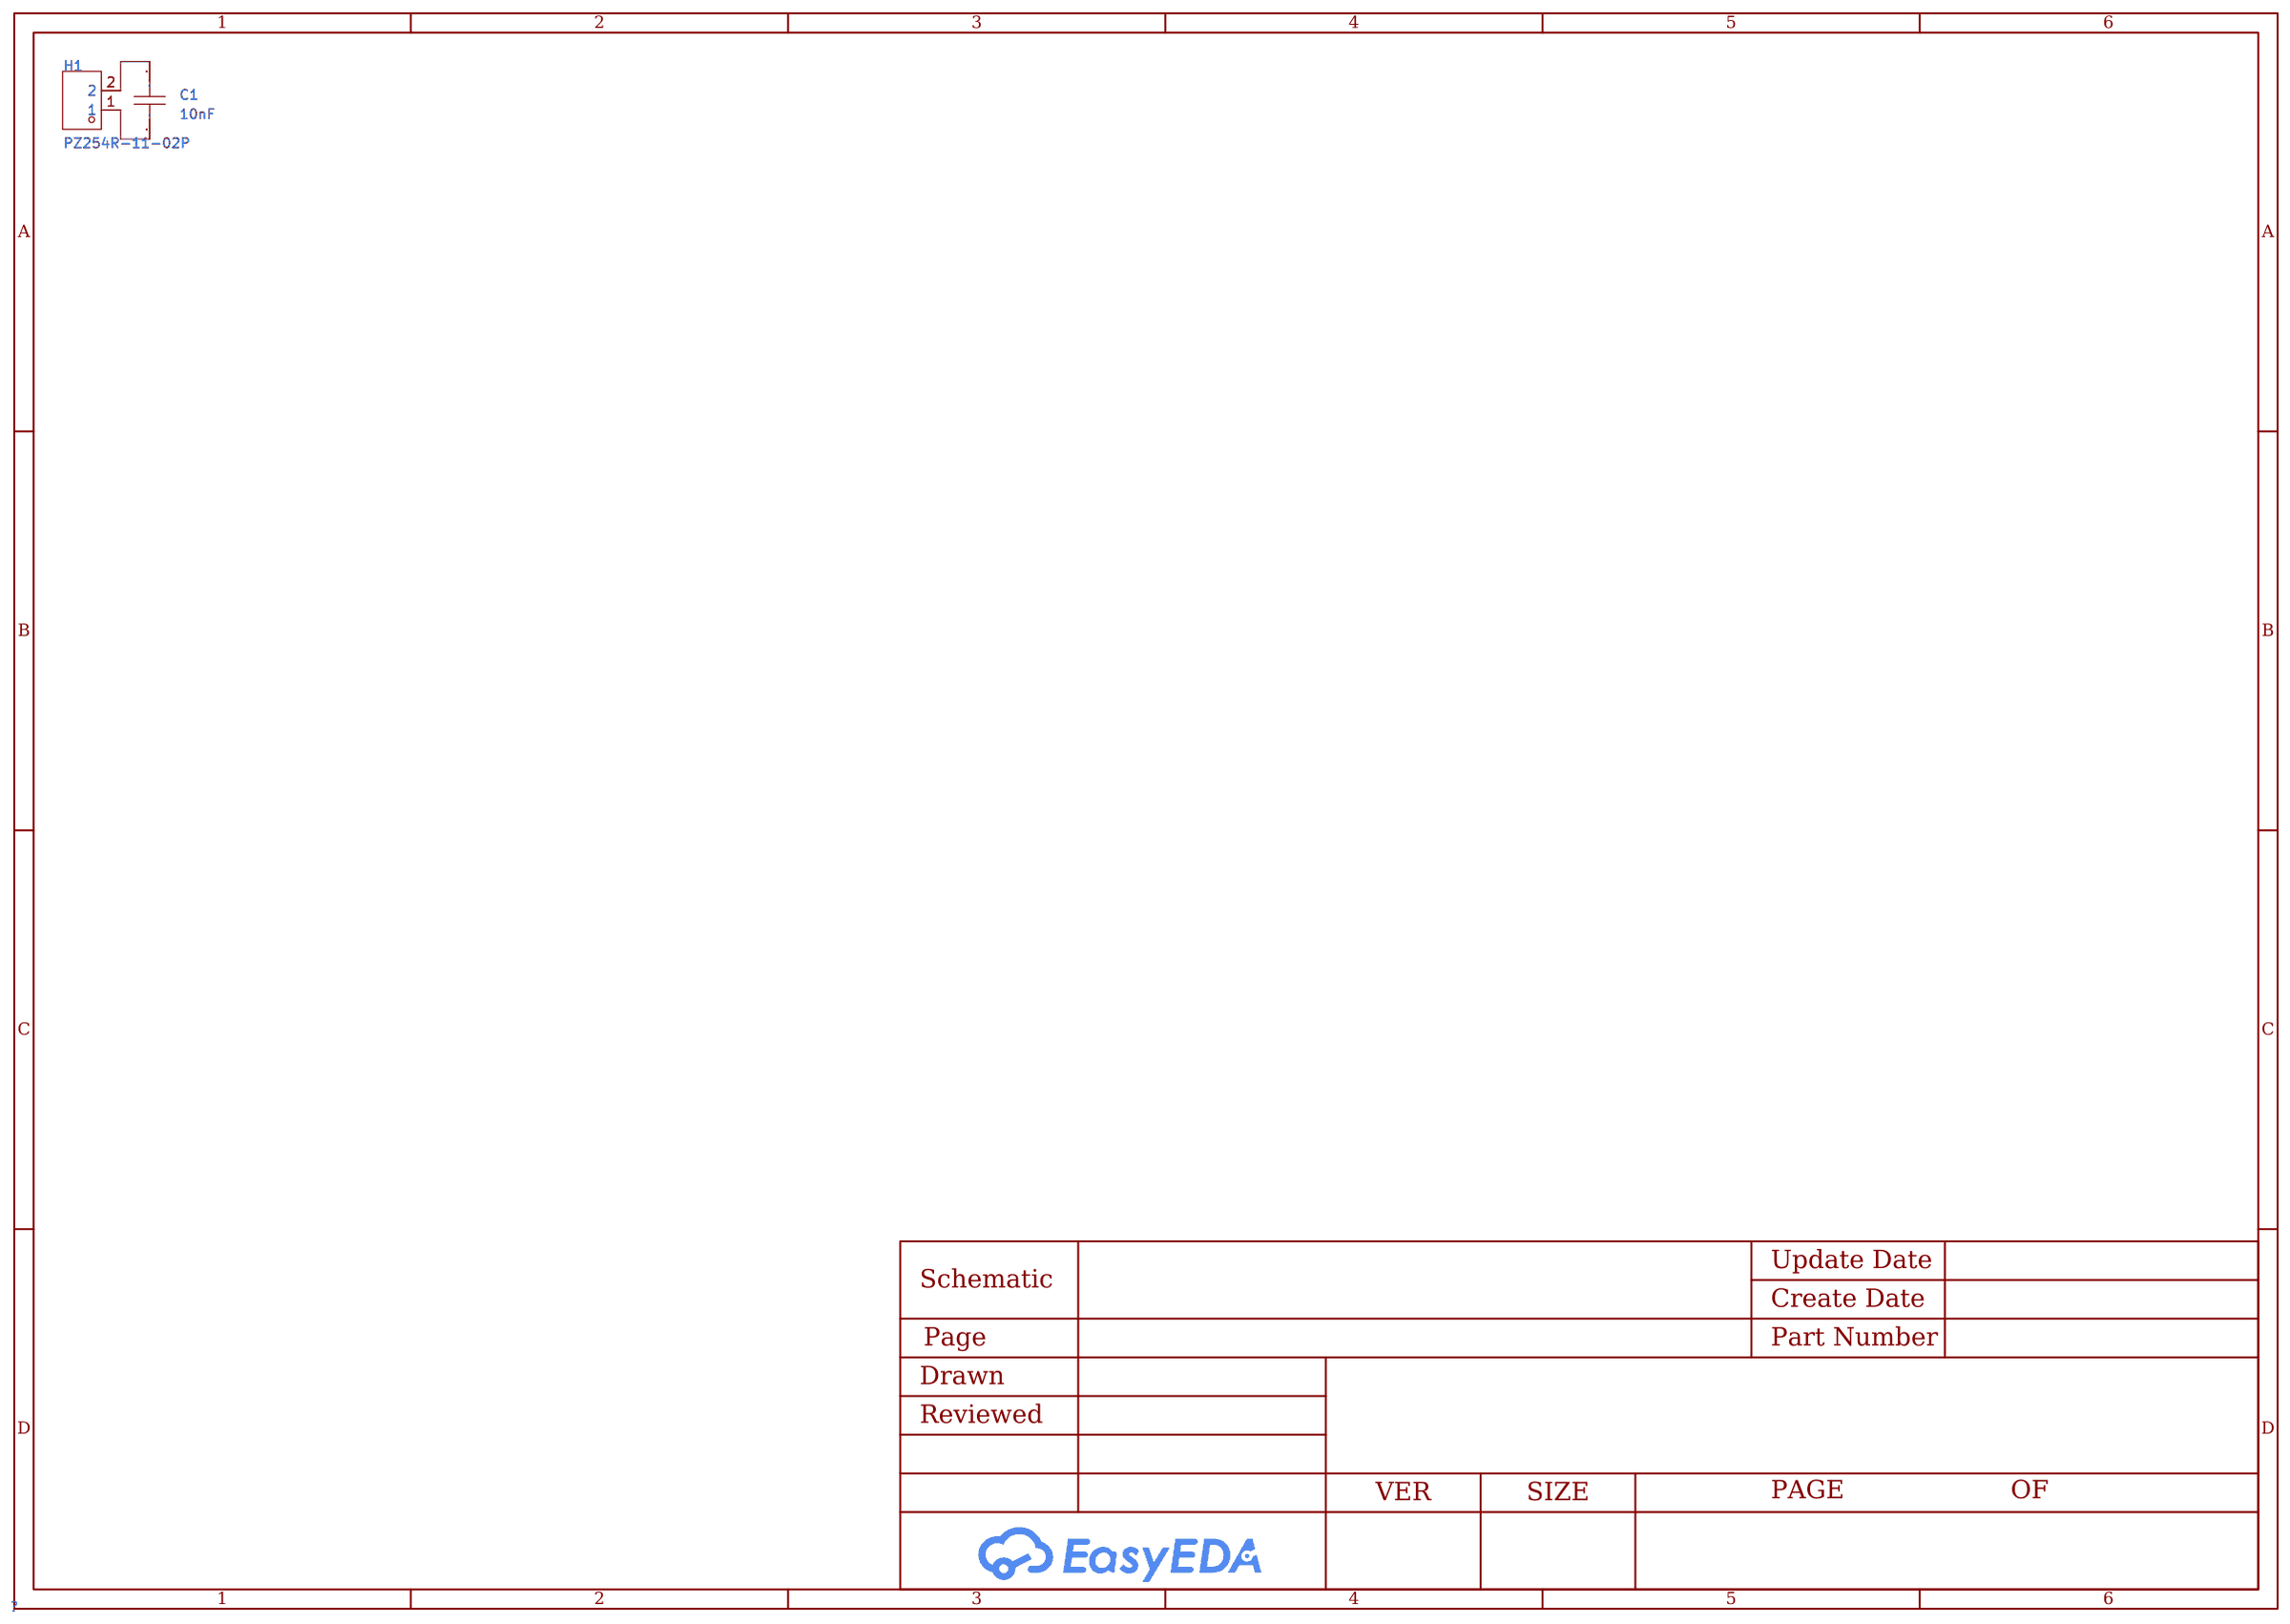
[diagram p8: schematic sheet]

## Parts
C1  10nF  [C0805]
H1  PZ254R-11-02P  [HDR-TH_2P-P2.54-H-M-W10.4]

## Library data of the parts
C1 = CC0805KRX7R9BB103: Capacitance: Tolerance:±10% Tolerance:±10% Voltage Rated: Temperature Coefficient:; LCSC Part Name: 10nF ±10% 50V; Supplier Part: C83170; Manufacturer: YAGEO(国巨); Supplier Footprint: 0805; JLCPCB Part Class: Extended Part; Datasheet: https://atta.szlcsc.com/upload/public/pdf/source/20170211/1486785656773.pdf; Supplier: LCSC; Tolerance: ±10%
H1 = PZ254R-11-02P: LCSC Part Name: 间距:2.54mm 1x2P 弯插 方针; Supplier Part: C492410; Manufacturer: XFCN(兴飞); Supplier Footprint: 弯插,P=2.54mm; JLCPCB Part Class: Extended Part; Datasheet: https://atta.szlcsc.com/upload/public/pdf/source/20200309/C492410_AD20A982E51A4870F6FD4D2413672598.pdf; Supplier: LCSC; Pin Structure: 1x2P; Pitch: 2.54mm; Circluar Pins/Square Pins: Square Pins; Mounting Type: Right-Angle; Number of Rows: Plugin; Number of Pins: 2P; Length of Mating Pin: 6mm; Insulation Height: 2.5mm; Operating Temperature Range: -40℃~+105℃; Color: Black

## Nets
$1N191: C1.2 H1.2
$1N196: C1.1 H1.1

# Schematic 100 uF Capacitor
Board Name: 100 uF Capacitor - X; Create Date: 2024-12-04; Page Name: P1; Project Name: Breadboard Components; Schematic Name: 100 uF Capacitor; Update Date: 2024-12-04; Company: EasyEDA.com; Drawn: EasyEDA; Page Size: A4; Part Number: JLCPCB-002; Reviewed: EasyEDA; Version: V0.1
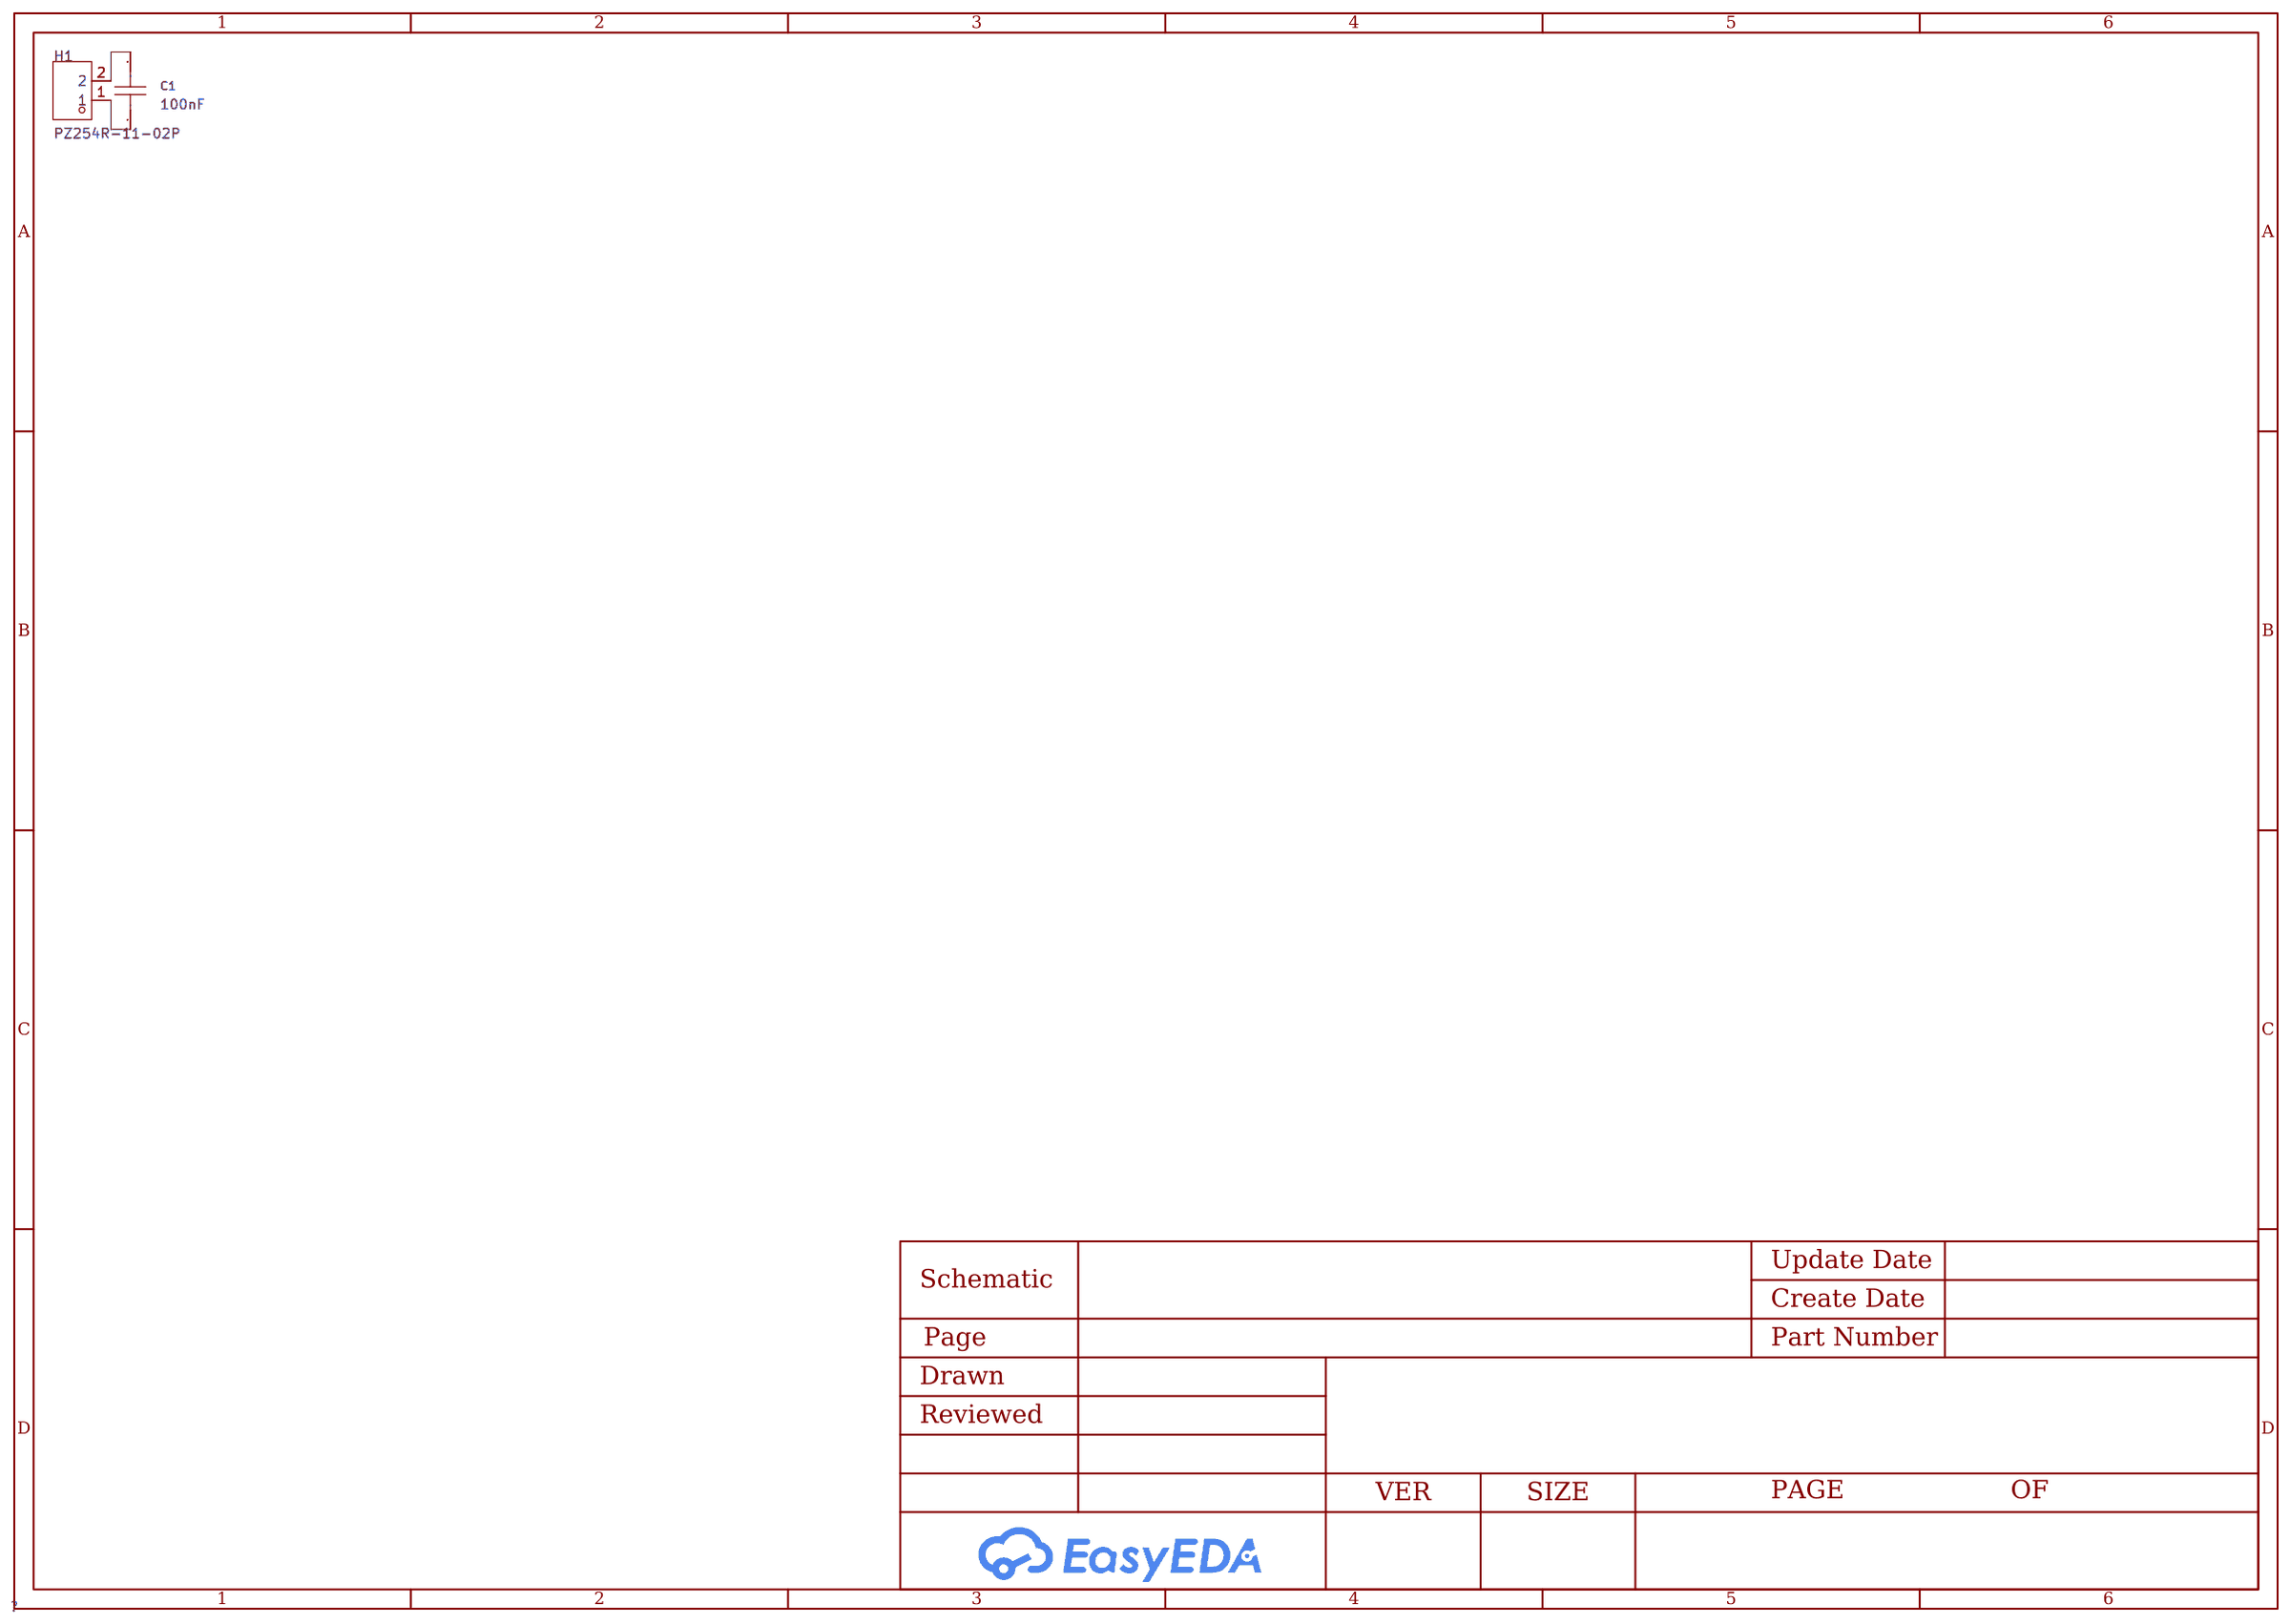
[diagram p9: schematic sheet]

## Parts
C1  100nF  [C0603]
H1  PZ254R-11-02P  [HDR-TH_2P-P2.54-H-M-W10.4]

## Library data of the parts
C1 = CC0603KRX7R9BB104: LCSC Part Name: 100nF ±10% 50V; Supplier Part: C14663; Manufacturer: YAGEO(国巨); Supplier Footprint: 0603; JLCPCB Part Class: Basic Part; Datasheet: https://atta.szlcsc.com/upload/public/pdf/source/20180910/C282072_33301C7F631E79921B82A8DAC6BCC5B3.pdf; Supplier: LCSC; Tolerance: ±10%
H1 = PZ254R-11-02P: LCSC Part Name: 间距:2.54mm 1x2P 弯插 方针; Supplier Part: C492410; Manufacturer: XFCN(兴飞); Supplier Footprint: 弯插,P=2.54mm; JLCPCB Part Class: Extended Part; Datasheet: https://atta.szlcsc.com/upload/public/pdf/source/20200309/C492410_AD20A982E51A4870F6FD4D2413672598.pdf; Supplier: LCSC; Pin Structure: 1x2P; Pitch: 2.54mm; Circluar Pins/Square Pins: Square Pins; Mounting Type: Right-Angle; Number of Rows: Plugin; Number of Pins: 2P; Length of Mating Pin: 6mm; Insulation Height: 2.5mm; Operating Temperature Range: -40℃~+105℃; Color: Black

## Nets
$1N155: C1.2 H1.2
$1N160: C1.1 H1.1

# Schematic 1MOhm Resistor
Board Name: 1MOhm Resistor; Create Date: 2024-12-04; Page Name: P1; Project Name: Breadboard Components; Schematic Name: 1MOhm Resistor; Update Date: 2024-12-04; Company: EasyEDA.com; Drawn: EasyEDA; Page Size: A4; Part Number: JLCPCB-002; Reviewed: EasyEDA; Version: V0.1
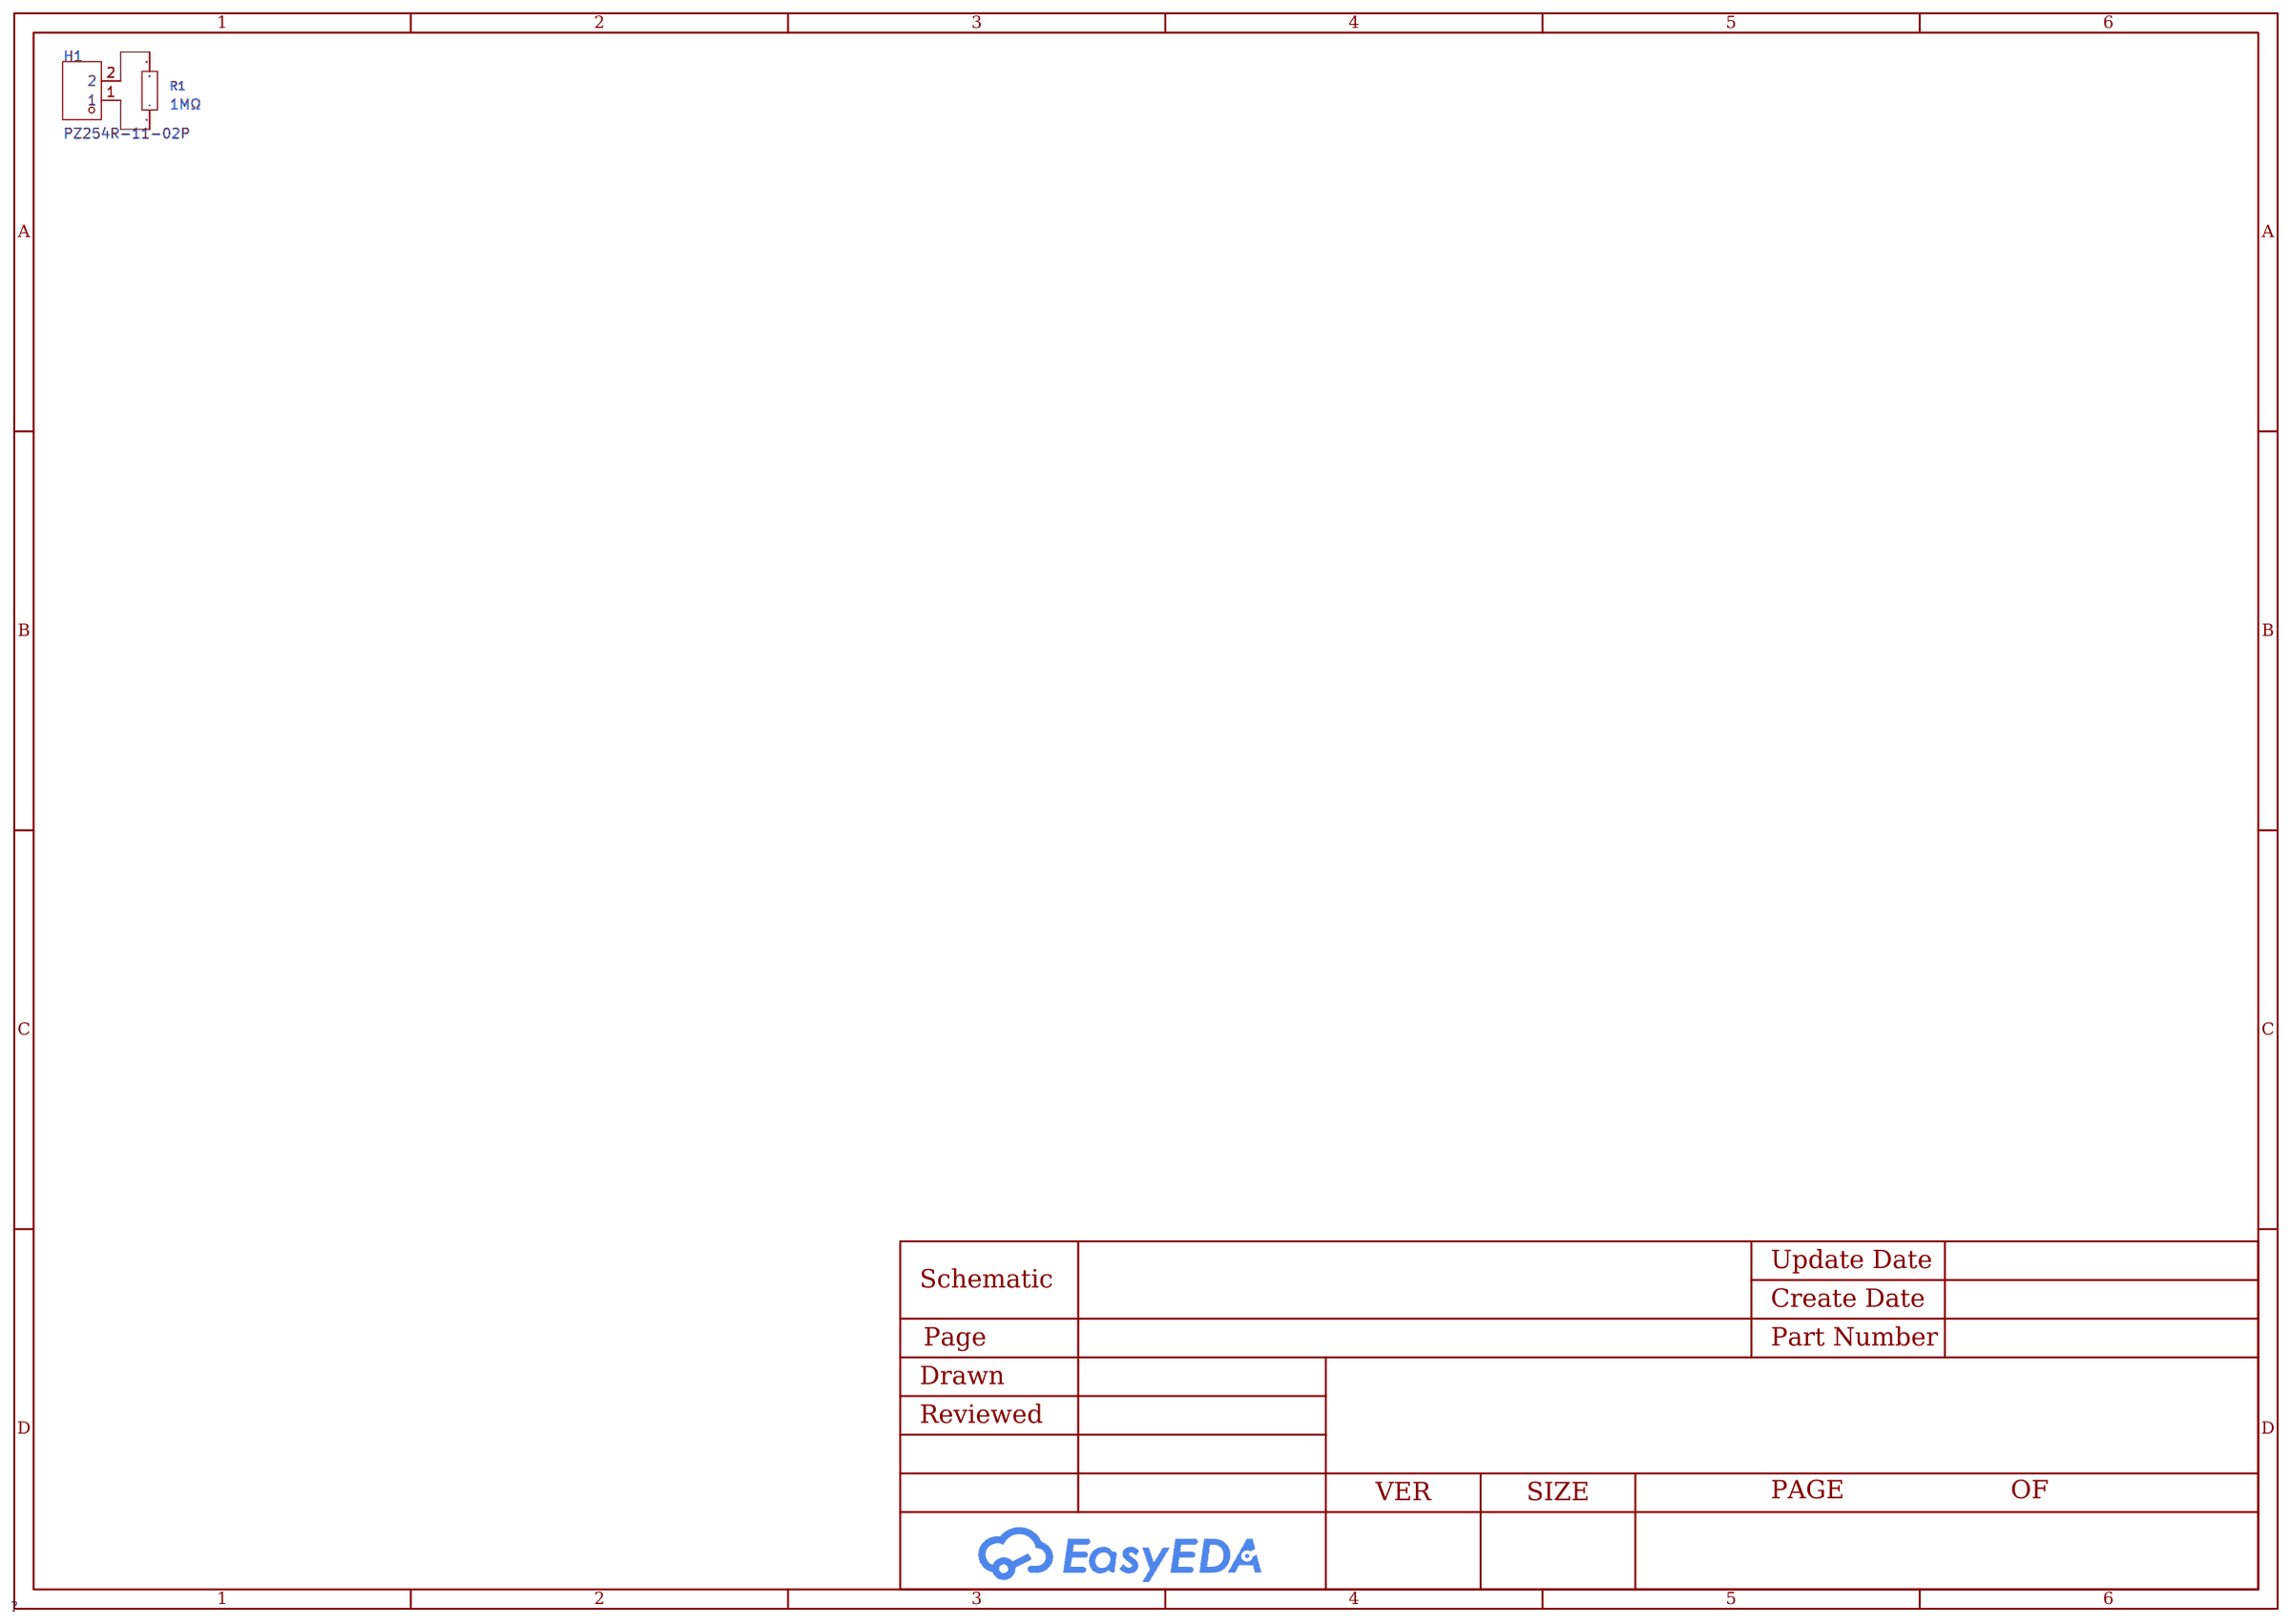
[diagram p10: schematic sheet]

## Parts
H1  PZ254R-11-02P  [HDR-TH_2P-P2.54-H-M-W10.4]
R1  1MΩ  [R1206]

## Library data of the parts
H1 = PZ254R-11-02P: LCSC Part Name: 间距:2.54mm 1x2P 弯插 方针; Supplier Part: C492410; Manufacturer: XFCN(兴飞); Supplier Footprint: 弯插,P=2.54mm; JLCPCB Part Class: Extended Part; Datasheet: https://atta.szlcsc.com/upload/public/pdf/source/20200309/C492410_AD20A982E51A4870F6FD4D2413672598.pdf; Supplier: LCSC; Pin Structure: 1x2P; Pitch: 2.54mm; Circluar Pins/Square Pins: Square Pins; Mounting Type: Right-Angle; Number of Rows: Plugin; Number of Pins: 2P; Length of Mating Pin: 6mm; Insulation Height: 2.5mm; Operating Temperature Range: -40℃~+105℃; Color: Black
R1 = 1206W4F1004T5E: LCSC Part Name: 1MΩ ±1% 250mW 厚膜电阻; Supplier Part: C17927; Manufacturer: UNI-ROYAL(厚声); Supplier Footprint: 1206; JLCPCB Part Class: Basic Part; Datasheet: https://atta.szlcsc.com/upload/public/pdf/source/20200306/C422600_1E6D84923E4A46A82E41ADD87F860B5C.pdf; Supplier: LCSC; Type: Thick Film Resistors; Tolerance: ±1%; Temperature Coefficient: ±100ppm/℃; Operating Temperature Range: -55℃~+155℃

## Nets
$1N161: H1.2 R1.2
$1N166: H1.1 R1.1

# Schematic NE555DR
Board Name: IC - NE555DR; Create Date: 2024-12-04; Page Name: P1; Project Name: Breadboard Components; Schematic Name: NE555DR; Update Date: 2024-12-04; Company: EasyEDA.com; Drawn: EasyEDA; Page Size: A4; Part Number: JLCPCB-002; Reviewed: EasyEDA; Version: V0.1
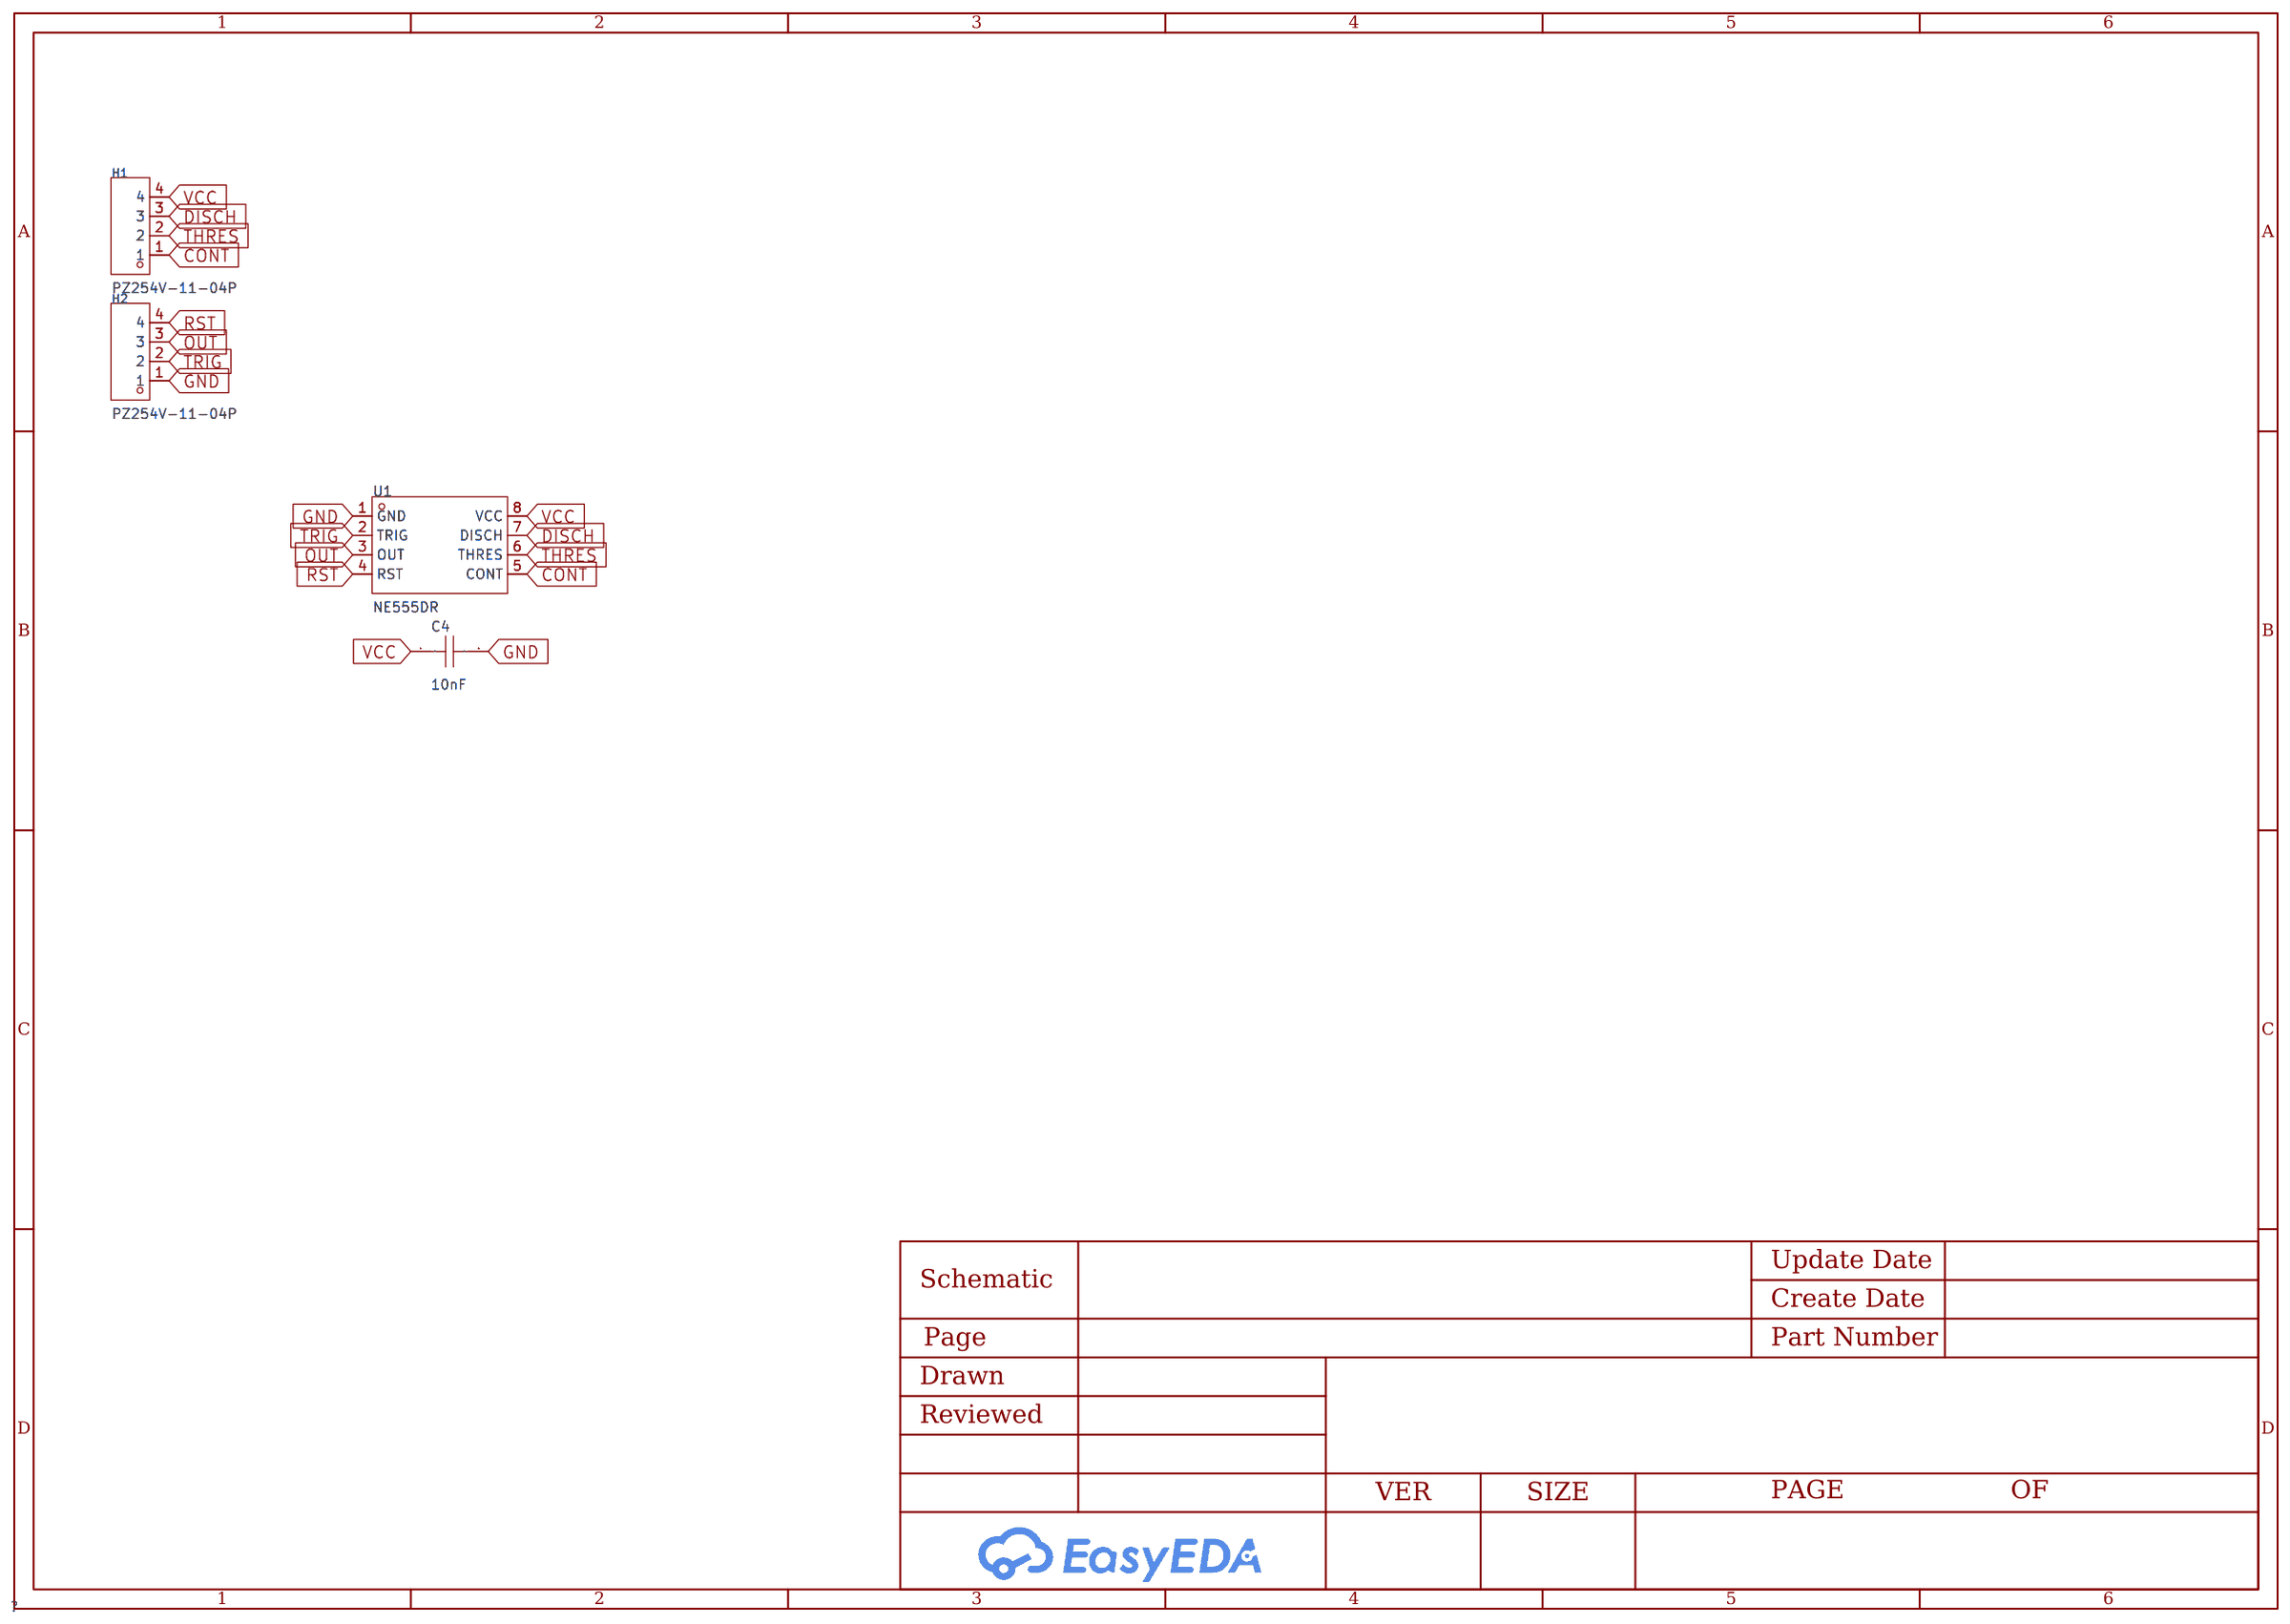
[diagram p11: schematic sheet]

## Parts
C4  10nF  [C0805]
H1  PZ254V-11-04P  [HDR-TH_4P-P2.54-V-M]
H2  PZ254V-11-04P  [HDR-TH_4P-P2.54-V-M]
U1  NE555DR  [SOIC-8_L4.9-W3.9-P1.27-LS6.0-BL]

## Library data of the parts
C4 = CC0805KRX7R9BB103: Capacitance: Tolerance:±10% Tolerance:±10% Voltage Rated: Temperature Coefficient:; LCSC Part Name: 10nF ±10% 50V; Supplier Part: C83170; Manufacturer: YAGEO(国巨); Supplier Footprint: 0805; JLCPCB Part Class: Extended Part; Datasheet: https://atta.szlcsc.com/upload/public/pdf/source/20170211/1486785656773.pdf; Supplier: LCSC; Tolerance: ±10%
H1 H2 = PZ254V-11-04P: LCSC Part Name: 间距:2.54mm 1x4P 直插 方针; Supplier Part: C2691448; Manufacturer: XFCN(兴飞); Supplier Footprint: 插件,P=2.54mm; JLCPCB Part Class: Extended Part; Datasheet: https://atta.szlcsc.com/upload/public/pdf/source/20200309/C492403_F9F19131791D08044AD4F84F8E751A34.pdf; Supplier: LCSC; Pin Structure: 1x4P; Pitch: 2.54mm; Circluar Pins/Square Pins: Square Pins; Mounting Type: Straight; Number of Rows: Plugin; Number of Pins: 4P; Current Rating (Max): 3A; Voltage Rating (Max): 250V; Length of Mating Pin: 6mm; Insulation Height: 2.5mm; Length of End Connection Pin: 3mm; Operating Temperature Range: -40℃~+105℃; Color: Black
U1 = NE555DR_1: Supplier Part: C41431778; Manufacturer: TECH PUBLIC(台舟); Supplier Footprint: SOP-8; Datasheet: https://atta.szlcsc.com/upload/public/pdf/source/20241023/45A85762FE8F4861FD26786892FF609A.pdf; Supplier: LCSC

## Nets
GND: C4.2 H2.1 U1.1(GND)
VCC: C4.1 H1.4 U1.8(VCC)
CONT: H1.1 U1.5(CONT)
DISCH: H1.3 U1.7(DISCH)
OUT: H2.3 U1.3(OUT)
RST: H2.4 U1.4(RST)
THRES: H1.2 U1.6(THRES)
TRIG: H2.2 U1.2(TRIG)
